# EAGLE schematic Compute Module (EAGLE 9.6.2), part 1 of 2

## Sheet 1 of 11
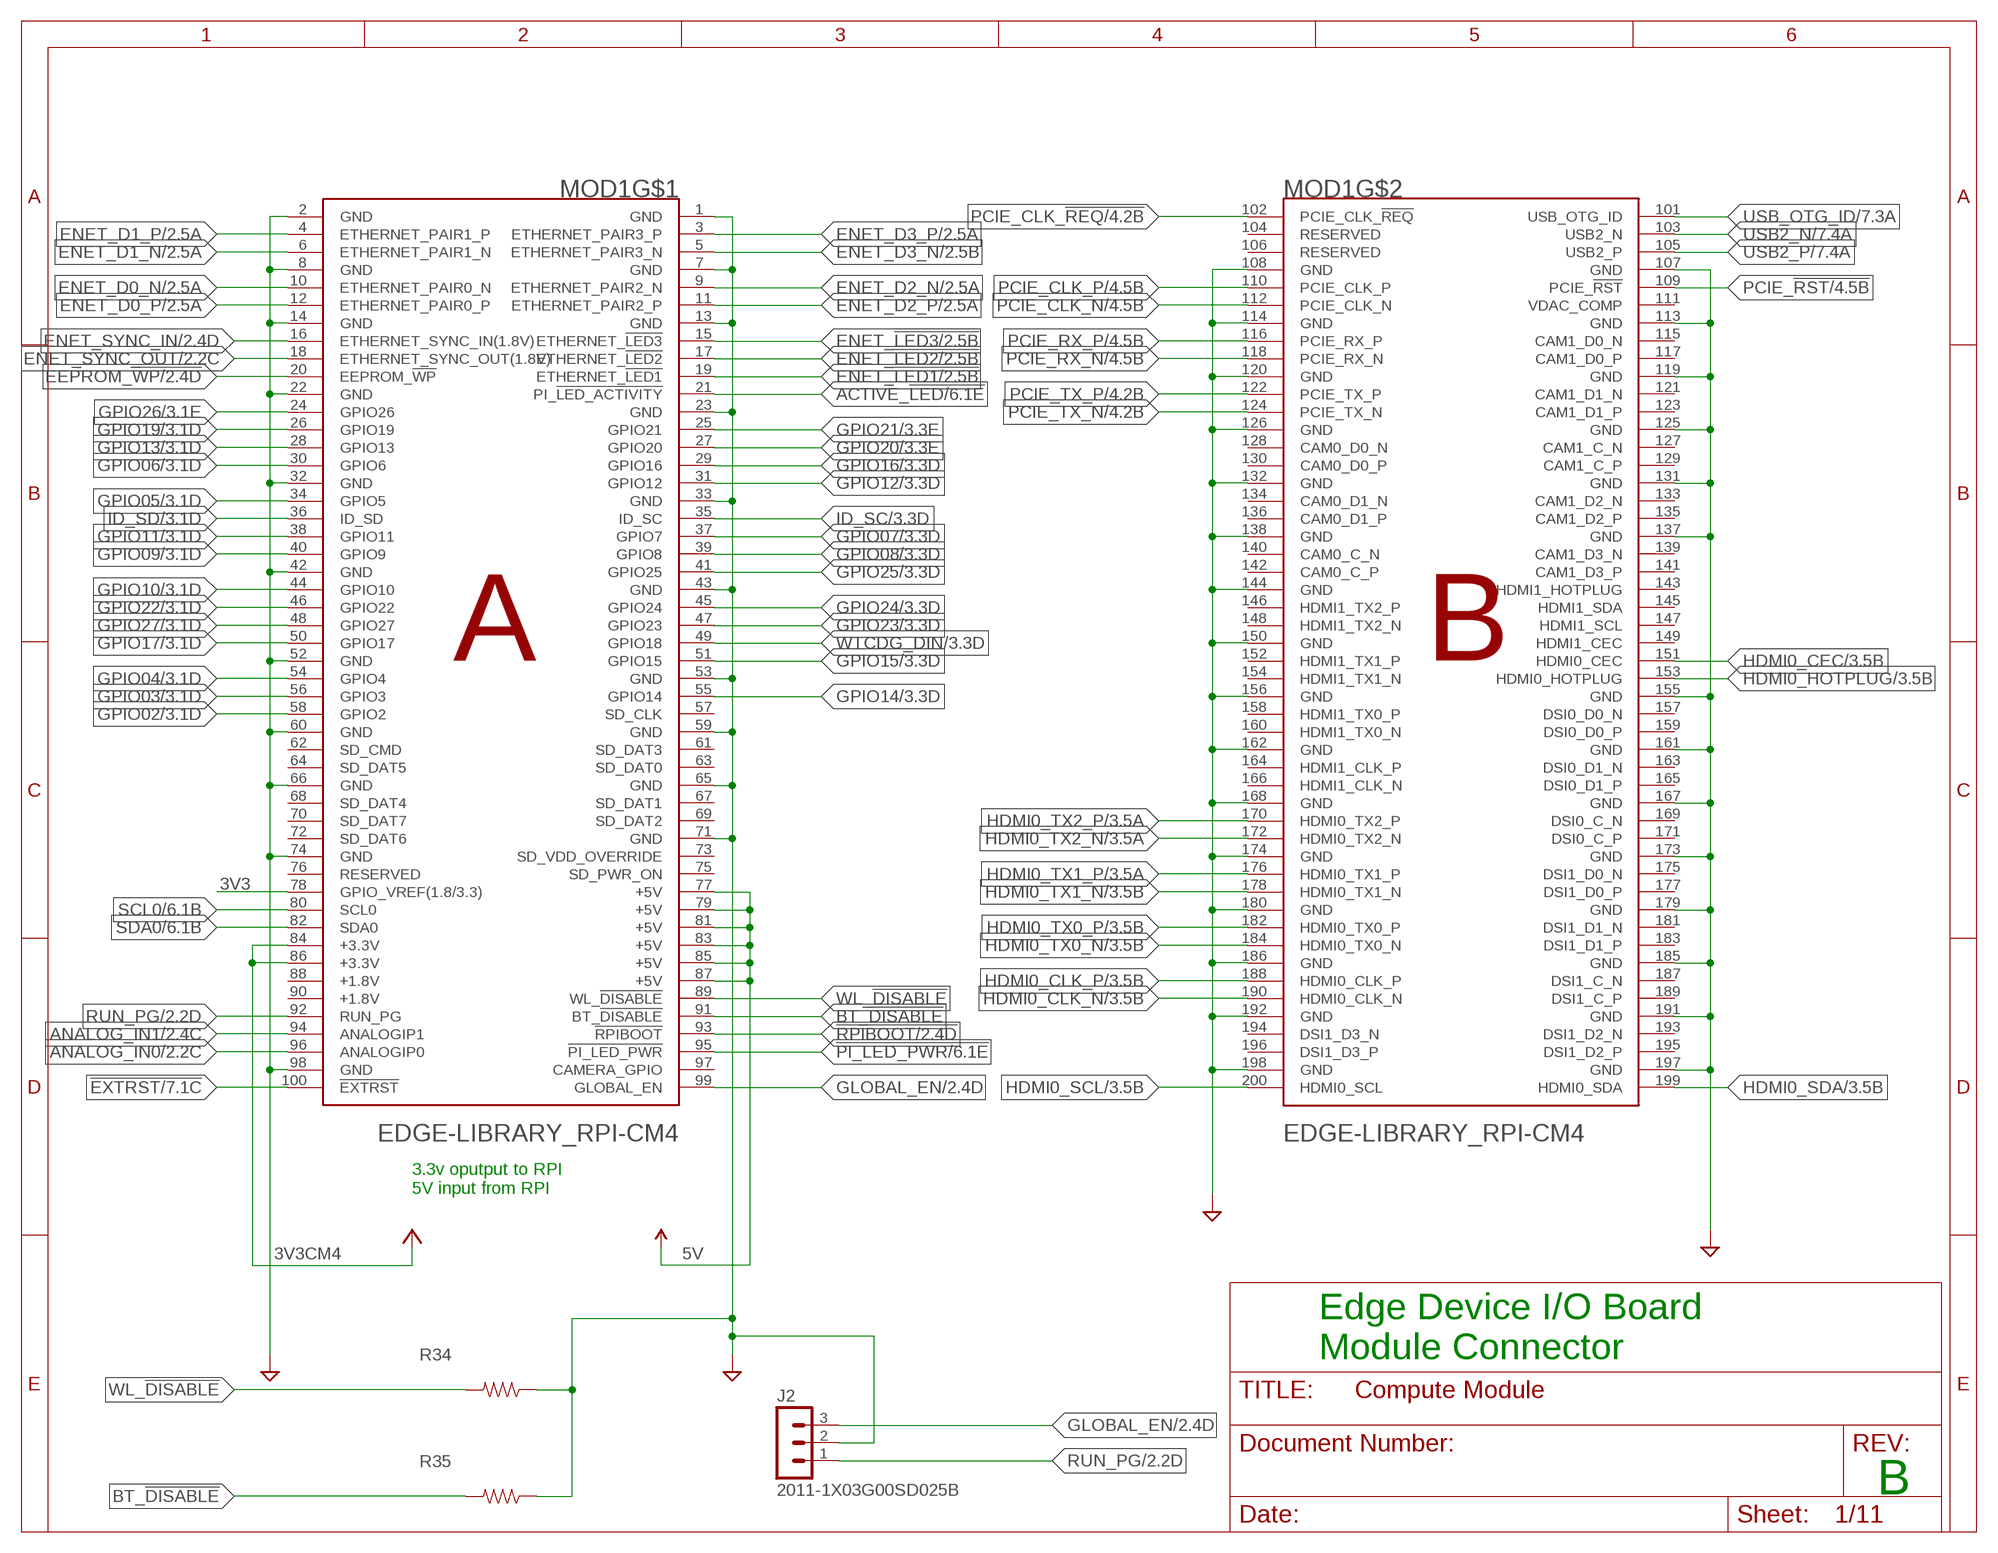
[diagram p0: schematic, sheet 1]

### Parts
J2  2011-1X03G00SD025B  CON-LSTB_MA03-1  [CON-LSTB_MA03-1]
MOD1  EDGE-LIBRARY_RPI-CM4  [EDGE-LIBRARY_RPI-CM4]
R34  EDGE-LIBRARY_RESISTOR0805  [EDGE-LIBRARY_0805]
R35  EDGE-LIBRARY_RESISTOR0805  [EDGE-LIBRARY_0805]

### Nets
3V3: MOD1.78(GPIO_VREF(1.8/3.3)) ; also sheet 2,3,4,5,6,7,9,10
3V3CM4: MOD1.84(+3.3V) MOD1.86(+3.3V) ; supply symbol labelled 3V3
5V: MOD1.77(+5V) MOD1.79(+5V) MOD1.81(+5V) MOD1.83(+5V) MOD1.85(+5V) MOD1.87(+5V) ; supply symbol labelled SUPPLY1_PWR ; also sheet 2,3,5,6
!EXTRST: MOD1.100(!EXTRST) ; also sheet 7
!PI_LED_PWR: MOD1.95(!PI_LED_PWR) ; also sheet 6
!RPIBOOT: MOD1.93(!RPIBOOT) ; also sheet 2,5
ACTIVE_!LED: MOD1.21(PI_!LED_ACTIVITY) ; also sheet 6
ANALOG_IN0: MOD1.96(ANALOGIP0) ; also sheet 2
ANALOG_IN1: MOD1.94(ANALOGIP1) ; also sheet 2
BT_!DISABLE: MOD1.91(BT_!DISABLE) R35.2
EEPROM_!WP: MOD1.20(EEPROM_!WP) ; also sheet 2
ENET_!LED1: MOD1.19(ETHERNET_!LED1) ; also sheet 2
ENET_!LED2: MOD1.17(ETHERNET_!LED2) ; also sheet 2
ENET_!LED3: MOD1.15(ETHERNET_!LED3) ; also sheet 2
ENET_D0_N [Ethernet 100]: MOD1.10(ETHERNET_PAIR0_N) ; also sheet 2
ENET_D0_P [Ethernet 100]: MOD1.12(ETHERNET_PAIR0_P) ; also sheet 2
ENET_D1_N [Ethernet 100]: MOD1.6(ETHERNET_PAIR1_N) ; also sheet 2
ENET_D1_P [Ethernet 100]: MOD1.4(ETHERNET_PAIR1_P) ; also sheet 2
ENET_D2_N [Ethernet 100]: MOD1.9(ETHERNET_PAIR2_N) ; also sheet 2
ENET_D2_P [Ethernet 100]: MOD1.11(ETHERNET_PAIR2_P) ; also sheet 2
ENET_D3_N [Ethernet 100]: MOD1.5(ETHERNET_PAIR3_N) ; also sheet 2
ENET_D3_P [Ethernet 100]: MOD1.3(ETHERNET_PAIR3_P) ; also sheet 2
ENET_SYNC_IN: MOD1.16(ETHERNET_SYNC_IN(1.8V)) ; also sheet 2
ENET_SYNC_OUT: MOD1.18(ETHERNET_SYNC_OUT(1.8V)) ; also sheet 2
GLOBAL_EN: J2.3 MOD1.99(GLOBAL_EN) ; also sheet 2,6
GND: J2.2 MOD1.1(GND) MOD1.2(GND) MOD1.7(GND) MOD1.8(GND) MOD1.13(GND) MOD1.14(GND) MOD1.22(GND) MOD1.23(GND) MOD1.32(GND) MOD1.33(GND) MOD1.42(GND) MOD1.43(GND) MOD1.52(GND) MOD1.53(GND) MOD1.59(GND) MOD1.60(GND) MOD1.65(GND) MOD1.66(GND) MOD1.71(GND) MOD1.74(GND) MOD1.98(GND) MOD1.107(GND) MOD1.108(GND) MOD1.113(GND) MOD1.114(GND) MOD1.119(GND) MOD1.120(GND) MOD1.125(GND) MOD1.126(GND) MOD1.131(GND) MOD1.132(GND) MOD1.137(GND) MOD1.138(GND) MOD1.144(GND) MOD1.150(GND) MOD1.155(GND) MOD1.156(GND) MOD1.161(GND) MOD1.162(GND) MOD1.167(GND) MOD1.168(GND) MOD1.173(GND) MOD1.174(GND) MOD1.179(GND) MOD1.180(GND) MOD1.185(GND) MOD1.186(GND) MOD1.191(GND) MOD1.192(GND) MOD1.197(GND) MOD1.198(GND) R34.1 R35.1 ; supply symbol labelled SUPPLY1_GND ; also sheet 2,3,4,5,6,7,8,9,10,11
GPIO02: MOD1.58(GPIO2) ; also sheet 3
GPIO03: MOD1.56(GPIO3) ; also sheet 3
GPIO04: MOD1.54(GPIO4) ; also sheet 3
GPIO05: MOD1.34(GPIO5) ; also sheet 3,11
GPIO06: MOD1.30(GPIO6) ; also sheet 3
GPIO07: MOD1.37(GPIO7) ; also sheet 3
GPIO08: MOD1.39(GPIO8) ; also sheet 3
GPIO09: MOD1.40(GPIO9) ; also sheet 3
GPIO10: MOD1.44(GPIO10) ; also sheet 3
GPIO11: MOD1.38(GPIO11) ; also sheet 3
GPIO12: MOD1.31(GPIO12) ; also sheet 3,8
GPIO13: MOD1.28(GPIO13) ; also sheet 3
GPIO14: MOD1.55(GPIO14) ; also sheet 3
GPIO15: MOD1.51(GPIO15) ; also sheet 3
GPIO16: MOD1.29(GPIO16) ; also sheet 3
GPIO17: MOD1.50(GPIO17) ; also sheet 3
GPIO19: MOD1.26(GPIO19) ; also sheet 3
GPIO20: MOD1.27(GPIO20) ; also sheet 3
GPIO21: MOD1.25(GPIO21) ; also sheet 3
GPIO22: MOD1.46(GPIO22) ; also sheet 3
GPIO23: MOD1.47(GPIO23) ; also sheet 3
GPIO24: MOD1.45(GPIO24) ; also sheet 3
GPIO25: MOD1.41(GPIO25) ; also sheet 3
GPIO26: MOD1.24(GPIO26) ; also sheet 3
GPIO27: MOD1.48(GPIO27) ; also sheet 3
HDMI0_CEC: MOD1.151(HDMI0_CEC) ; also sheet 3
HDMI0_CLK_N [HDMI 100]: MOD1.190(HDMI0_CLK_N) ; also sheet 3
HDMI0_CLK_P [HDMI 100]: MOD1.188(HDMI0_CLK_P) ; also sheet 3
HDMI0_HOTPLUG: MOD1.153(HDMI0_HOTPLUG) ; also sheet 3
HDMI0_SCL: MOD1.200(HDMI0_SCL) ; also sheet 3
HDMI0_SDA: MOD1.199(HDMI0_SDA) ; also sheet 3
HDMI0_TX0_N [HDMI 100]: MOD1.184(HDMI0_TX0_N) ; also sheet 3
HDMI0_TX0_P [HDMI 100]: MOD1.182(HDMI0_TX0_P) ; also sheet 3
HDMI0_TX1_N [HDMI 100]: MOD1.178(HDMI0_TX1_N) ; also sheet 3
HDMI0_TX1_P [HDMI 100]: MOD1.176(HDMI0_TX1_P) ; also sheet 3
HDMI0_TX2_N [HDMI 100]: MOD1.172(HDMI0_TX2_N) ; also sheet 3
HDMI0_TX2_P [HDMI 100]: MOD1.170(HDMI0_TX2_P) ; also sheet 3
ID_SC: MOD1.35(ID_SC) ; also sheet 3
ID_SD: MOD1.36(ID_SD) ; also sheet 3
PCIE_!RST: MOD1.109(PCIE_!RST) ; also sheet 4
PCIE_CLK_!REQ: MOD1.102(PCIE_CLK_!REQ) ; also sheet 4
PCIE_CLK_N [PCI 90]: MOD1.112(PCIE_CLK_N) ; also sheet 4
PCIE_CLK_P [PCI 90]: MOD1.110(PCIE_CLK_P) ; also sheet 4
PCIE_RX_N [PCI 90]: MOD1.118(PCIE_RX_N) ; also sheet 4
PCIE_RX_P [PCI 90]: MOD1.116(PCIE_RX_P) ; also sheet 4
PCIE_TX_N [PCI 90]: MOD1.124(PCIE_TX_N) ; also sheet 4
PCIE_TX_P [PCI 90]: MOD1.122(PCIE_TX_P) ; also sheet 4
RUN_PG: J2.1 MOD1.92(RUN_PG) ; also sheet 2
SCL0: MOD1.80(SCL0) ; also sheet 6
SDA0: MOD1.82(SDA0) ; also sheet 6
USB2_N [USB 90]: MOD1.103(USB2_N) ; also sheet 7
USB2_P [USB 90]: MOD1.105(USB2_P) ; also sheet 7
USB_OTG_ID: MOD1.101(USB_OTG_ID) ; also sheet 7
WL_!DISABLE: MOD1.89(WL_!DISABLE) R34.2
WTCDG_DIN: MOD1.49(GPIO18) ; also sheet 3,5
Unconnected: MOD1.57(SD_CLK) MOD1.61(SD_DAT3) MOD1.62(SD_CMD) MOD1.63(SD_DAT0) MOD1.64(SD_DAT5) MOD1.67(SD_DAT1) MOD1.68(SD_DAT4) MOD1.69(SD_DAT2) MOD1.70(SD_DAT7) MOD1.72(SD_DAT6) MOD1.73(SD_VDD_OVERRIDE) MOD1.75(SD_PWR_ON) MOD1.76(RESERVED) MOD1.88(+1.8V) MOD1.90(+1.8V) MOD1.97(CAMERA_GPIO) MOD1.104(RESERVED) MOD1.106(RESERVED) MOD1.111(VDAC_COMP) MOD1.115(CAM1_D0_N) MOD1.117(CAM1_D0_P) MOD1.121(CAM1_D1_N) MOD1.123(CAM1_D1_P) MOD1.127(CAM1_C_N) MOD1.128(CAM0_D0_N) MOD1.129(CAM1_C_P) MOD1.130(CAM0_D0_P) MOD1.133(CAM1_D2_N) MOD1.134(CAM0_D1_N) MOD1.135(CAM1_D2_P) MOD1.136(CAM0_D1_P) MOD1.139(CAM1_D3_N) MOD1.140(CAM0_C_N) MOD1.141(CAM1_D3_P) MOD1.142(CAM0_C_P) MOD1.143(HDMI1_HOTPLUG) MOD1.145(HDMI1_SDA) MOD1.146(HDMI1_TX2_P) MOD1.147(HDMI1_SCL) MOD1.148(HDMI1_TX2_N) MOD1.149(HDMI1_CEC) MOD1.152(HDMI1_TX1_P) MOD1.154(HDMI1_TX1_N) MOD1.157(DSI0_D0_N) MOD1.158(HDMI1_TX0_P) MOD1.159(DSI0_D0_P) MOD1.160(HDMI1_TX0_N) MOD1.163(DSI0_D1_N) MOD1.164(HDMI1_CLK_P) MOD1.165(DSI0_D1_P) MOD1.166(HDMI1_CLK_N) MOD1.169(DSI0_C_N) MOD1.171(DSI0_C_P) MOD1.175(DSI1_D0_N) MOD1.177(DSI1_D0_P) MOD1.181(DSI1_D1_N) MOD1.183(DSI1_D1_P) MOD1.187(DSI1_C_N) MOD1.189(DSI1_C_P) MOD1.193(DSI1_D2_N) MOD1.194(DSI1_D3_N) MOD1.195(DSI1_D2_P) MOD1.196(DSI1_D3_P)

### Notes on the sheet
- 3.3v oputput to RPI
  5V input from RPI
- Edge Device I/O Board
  Module Connector
- B

## Sheet 2 of 11
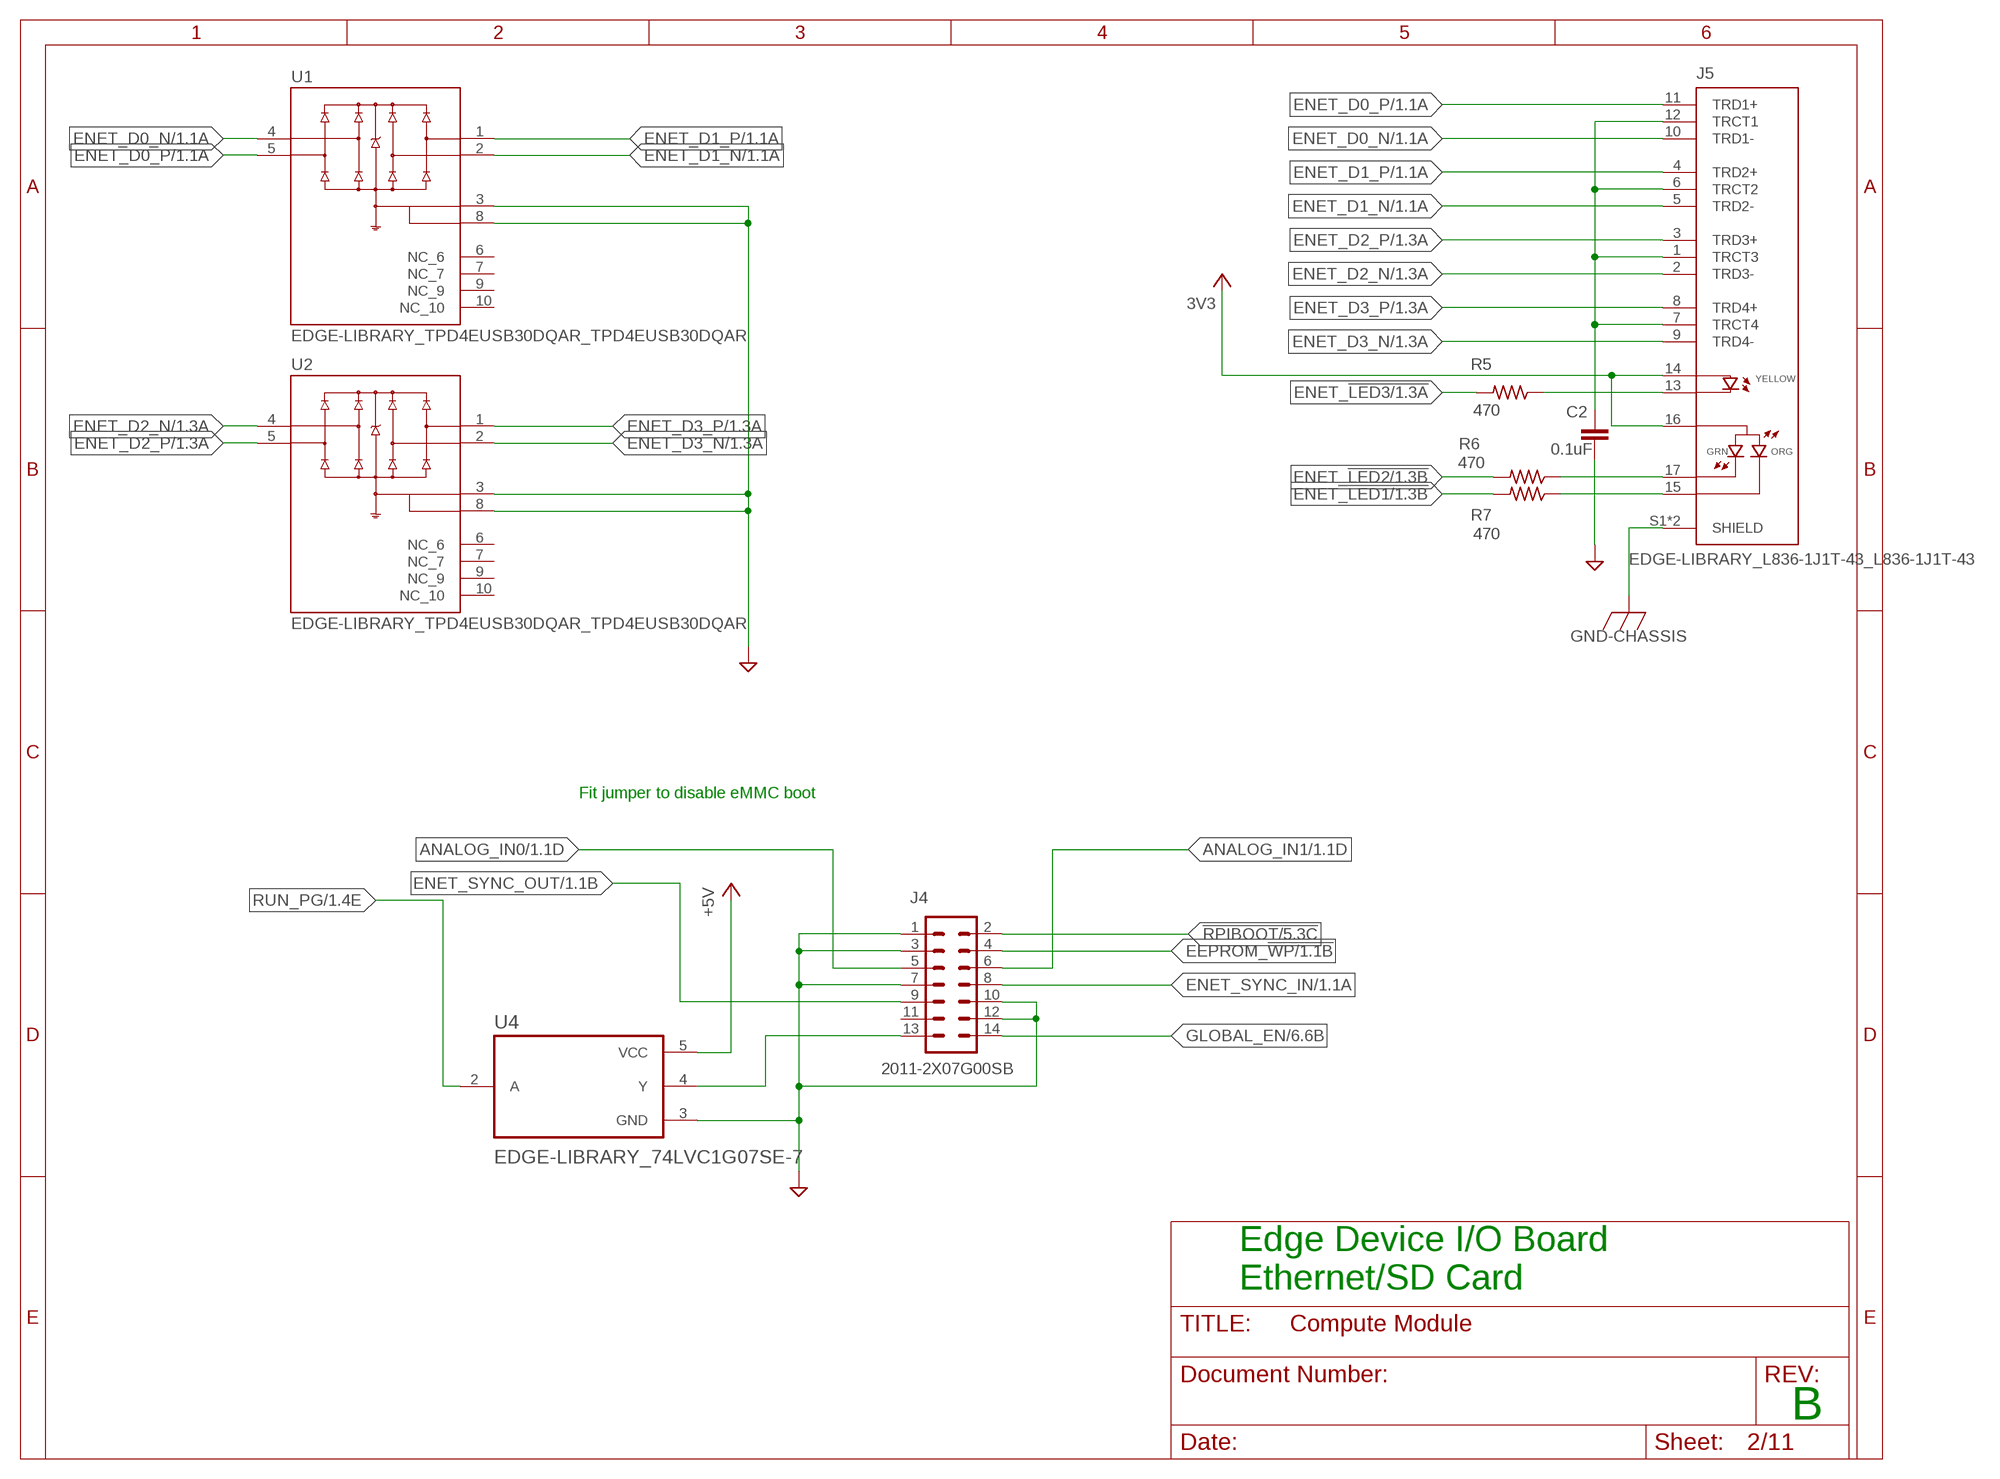
[diagram p1: schematic, sheet 2]

### Parts
C2  0.1uF  EDGE-LIBRARY_TUTORIAL---FUSION-360_CCHIP-0402(1005-METRIC)  [EDGE-LIBRARY_TUTORIAL---FUSION-360_CAPC1005X60]
J4  2011-2X07G00SB  CON-LSTB_MA07-2  [CON-LSTB_MA07-2]
J5  EDGE-LIBRARY_L836-1J1T-43_L836-1J1T-43  [EDGE-LIBRARY_L836-1J1T-43_BEL_L836-1J1T-43]
R5  470  EDGE-LIBRARY_TUTORIAL---FUSION-360_R-USCHIP-0402(1005-METRIC)  [EDGE-LIBRARY_TUTORIAL---FUSION-360_RESC1005X40]
R6  470  EDGE-LIBRARY_TUTORIAL---FUSION-360_R-USCHIP-0402(1005-METRIC)  [EDGE-LIBRARY_TUTORIAL---FUSION-360_RESC1005X40]
R7  470  EDGE-LIBRARY_TUTORIAL---FUSION-360_R-USCHIP-0402(1005-METRIC)  [EDGE-LIBRARY_TUTORIAL---FUSION-360_RESC1005X40]
U1  EDGE-LIBRARY_TPD4EUSB30DQAR_TPD4EUSB30DQAR  [EDGE-LIBRARY_TPD4EUSB30DQAR_IC_TPD4EUSB30DQAR]
U2  EDGE-LIBRARY_TPD4EUSB30DQAR_TPD4EUSB30DQAR  [EDGE-LIBRARY_TPD4EUSB30DQAR_IC_TPD4EUSB30DQAR]
U4  EDGE-LIBRARY_74LVC1G07SE-7  [EDGE-LIBRARY_SOT65P210X110-5N]

### Nets
3V3: J5.14 J5.16 ; also sheet 1,3,4,5,6,7,9,10
5V: U4.5(VCC) ; supply symbol labelled +5V ; also sheet 1,3,5,6
!RPIBOOT: J4.2 ; also sheet 1,5
ANALOG_IN0: J4.5 ; also sheet 1
ANALOG_IN1: J4.6 ; also sheet 1
CGND: J5.S1(SHIELD) J5.S2(SHIELD) ; supply symbol labelled GND-CHASSIS ; also sheet 3,4,7,9
EEPROM_!WP: J4.4 ; also sheet 1
ENET_!LED1: R7.2 ; also sheet 1
ENET_!LED2: R6.2 ; also sheet 1
ENET_!LED3: R5.2 ; also sheet 1
ENET_D0_N [Ethernet 100]: J5.10(TRD1-) U1.4(D2+) ; also sheet 1
ENET_D0_P [Ethernet 100]: J5.11(TRD1+) U1.5(D2-) ; also sheet 1
ENET_D1_N [Ethernet 100]: J5.5(TRD2-) U1.2(D1-) ; also sheet 1
ENET_D1_P [Ethernet 100]: J5.4(TRD2+) U1.1(D1+) ; also sheet 1
ENET_D2_N [Ethernet 100]: J5.2(TRD3-) U2.4(D2+) ; also sheet 1
ENET_D2_P [Ethernet 100]: J5.3(TRD3+) U2.5(D2-) ; also sheet 1
ENET_D3_N [Ethernet 100]: J5.9(TRD4-) U2.2(D1-) ; also sheet 1
ENET_D3_P [Ethernet 100]: J5.8(TRD4+) U2.1(D1+) ; also sheet 1
ENET_SYNC_IN: J4.8 ; also sheet 1
ENET_SYNC_OUT: J4.9 ; also sheet 1
GLOBAL_EN: J4.14 ; also sheet 1,6
GND: C2.2 J4.1 J4.3 J4.7 J4.10 J4.12 U1.3(GND_3) U1.8(GND_8) U2.3(GND_3) U2.8(GND_8) U4.3(GND) ; supply symbol labelled SUPPLY1_GND ; also sheet 1,3,4,5,6,7,8,9,10,11
N$3: C2.1 J5.1(TRCT3) J5.6(TRCT2) J5.7(TRCT4) J5.12(TRCT1)
N$4: J5.13 R5.1
N$11: J5.17 R6.1
N$12: J5.15 R7.1
N$87: J4.13 U4.4(Y)
RUN_PG: U4.2(A) ; also sheet 1
Unconnected: J4.11 U1.6(NC_6) U1.7(NC_7) U1.9(NC_9) U1.10(NC_10) U2.6(NC_6) U2.7(NC_7) U2.9(NC_9) U2.10(NC_10)

### Notes on the sheet
- Fit jumper to disable eMMC boot
- Edge Device I/O Board
  Ethernet/SD Card
- B

## Sheet 3 of 11
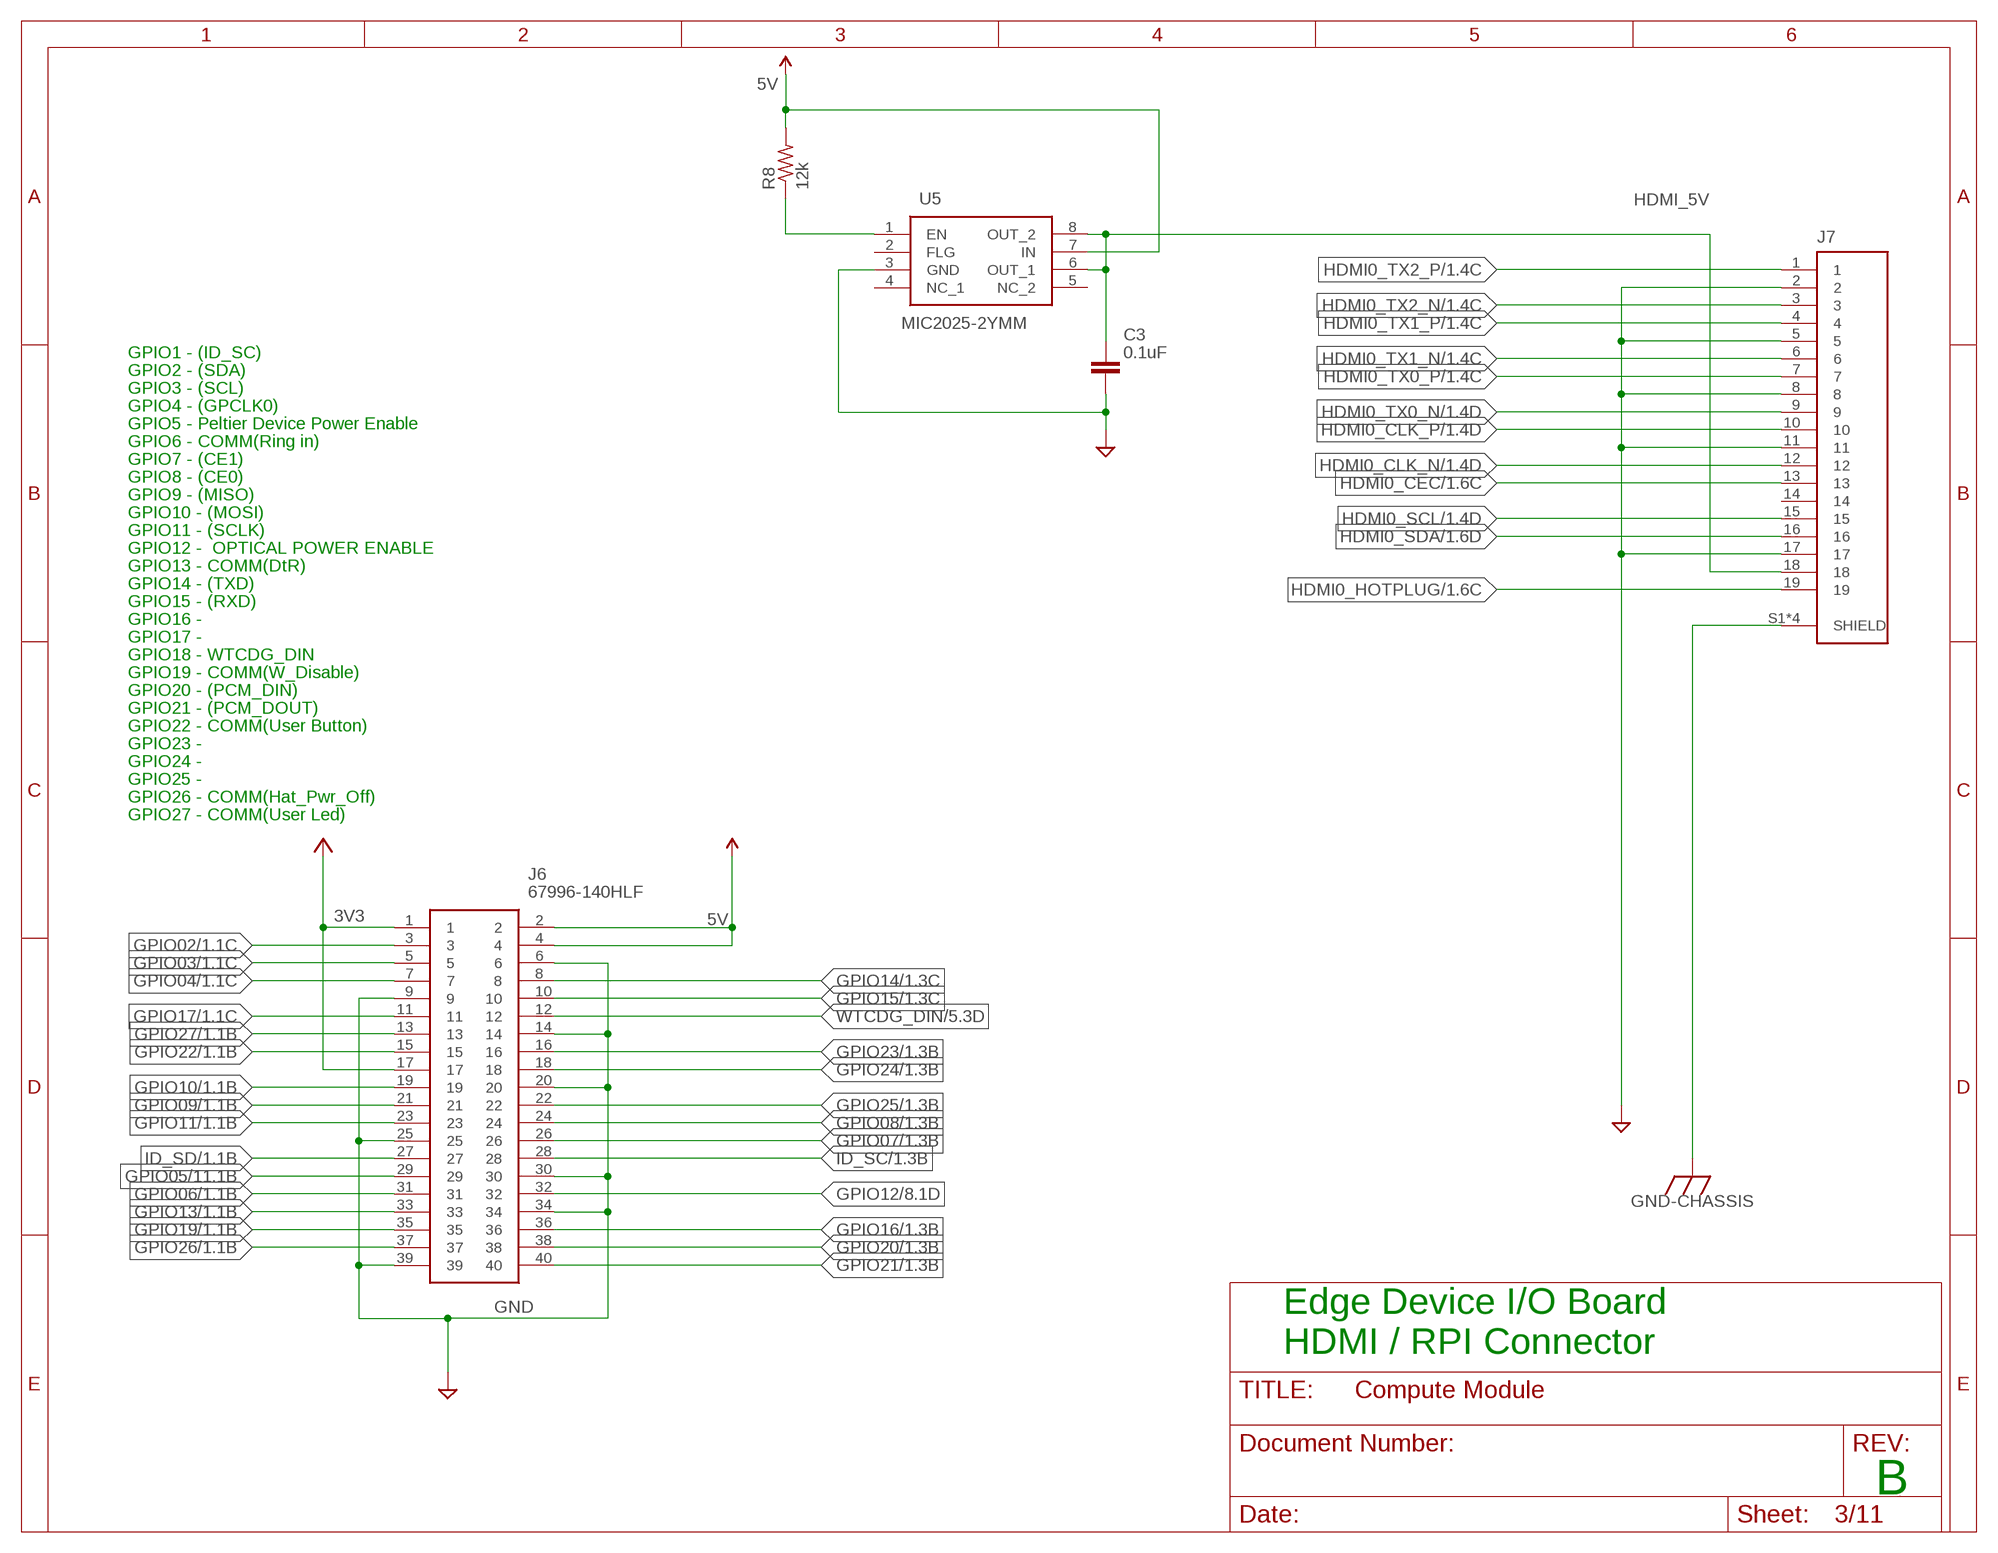
[diagram p2: schematic, sheet 3]

### Parts
C3  0.1uF  EDGE-LIBRARY_TUTORIAL---FUSION-360_CCHIP-0402(1005-METRIC)  [EDGE-LIBRARY_TUTORIAL---FUSION-360_CAPC1005X60]
J6  67996-140HLF  [HDRV40W67P254_2X20_5080X483X85]
J7  EDGE-LIBRARY_HDMI_CONNECTOR_RT_SMA  [EDGE-LIBRARY_STEWART_SS-53000-001]
R8  12k  EDGE-LIBRARY_TUTORIAL---FUSION-360_R-USCHIP-0402(1005-METRIC)  [EDGE-LIBRARY_TUTORIAL---FUSION-360_RESC1005X40]
U5  MIC2025-2YMM  [SOP65P490X110-8N]

### Nets
3V3: J6.1 J6.17 ; also sheet 1,2,4,5,6,7,9,10
5V: J6.2 J6.4 R8.2 U5.7(IN) ; supply symbol labelled SPARKFUN-POWERSYMBOLS_5V ; also sheet 1,2,5,6
CGND: J7.S1(SHIELD) J7.S2(SHIELD) J7.S3(SHIELD) J7.S4(SHIELD) ; supply symbol labelled GND-CHASSIS ; also sheet 2,4,7,9
GND: C3.2 J6.6 J6.9 J6.14 J6.20 J6.25 J6.30 J6.34 J6.39 J7.2 J7.5 J7.8 J7.11 J7.17 U5.3(GND) ; supply symbol labelled SUPPLY1_GND ; also sheet 1,2,4,5,6,7,8,9,10,11
GPIO02: J6.3 ; also sheet 1
GPIO03: J6.5 ; also sheet 1
GPIO04: J6.7 ; also sheet 1
GPIO05: J6.29 ; also sheet 1,11
GPIO06: J6.31 ; also sheet 1
GPIO07: J6.26 ; also sheet 1
GPIO08: J6.24 ; also sheet 1
GPIO09: J6.21 ; also sheet 1
GPIO10: J6.19 ; also sheet 1
GPIO11: J6.23 ; also sheet 1
GPIO12: J6.32 ; also sheet 1,8
GPIO13: J6.33 ; also sheet 1
GPIO14: J6.8 ; also sheet 1
GPIO15: J6.10 ; also sheet 1
GPIO16: J6.36 ; also sheet 1
GPIO17: J6.11 ; also sheet 1
GPIO19: J6.35 ; also sheet 1
GPIO20: J6.38 ; also sheet 1
GPIO21: J6.40 ; also sheet 1
GPIO22: J6.15 ; also sheet 1
GPIO23: J6.16 ; also sheet 1
GPIO24: J6.18 ; also sheet 1
GPIO25: J6.22 ; also sheet 1
GPIO26: J6.37 ; also sheet 1
GPIO27: J6.13 ; also sheet 1
HDMI0_CEC: J7.13 ; also sheet 1
HDMI0_CLK_N [HDMI 100]: J7.12 ; also sheet 1
HDMI0_CLK_P [HDMI 100]: J7.10 ; also sheet 1
HDMI0_HOTPLUG: J7.19 ; also sheet 1
HDMI0_SCL: J7.15 ; also sheet 1
HDMI0_SDA: J7.16 ; also sheet 1
HDMI0_TX0_N [HDMI 100]: J7.9 ; also sheet 1
HDMI0_TX0_P [HDMI 100]: J7.7 ; also sheet 1
HDMI0_TX1_N [HDMI 100]: J7.6 ; also sheet 1
HDMI0_TX1_P [HDMI 100]: J7.4 ; also sheet 1
HDMI0_TX2_N [HDMI 100]: J7.3 ; also sheet 1
HDMI0_TX2_P [HDMI 100]: J7.1 ; also sheet 1
HDMI_5V: C3.1 J7.18 U5.6(OUT_1) U5.8(OUT_2)
ID_SC: J6.28 ; also sheet 1
ID_SD: J6.27 ; also sheet 1
N$7: R8.1 U5.1(EN)
WTCDG_DIN: J6.12 ; also sheet 1,5
Unconnected: J7.14 U5.2(FLG) U5.4(NC_1) U5.5(NC_2)

### Notes on the sheet
- GPIO1 - (ID_SC)
- GPIO2 - (SDA)
- GPIO3 - (SCL)
- GPIO4 - (GPCLK0)
- GPIO5 - Peltier Device Power Enable
- GPIO6 - COMM(Ring in)
- GPIO7 - (CE1)
- GPIO8 - (CE0)
- GPIO9 - (MISO)
- GPIO10 - (MOSI)
- GPIO11 - (SCLK)
- GPIO12 -  OPTICAL POWER ENABLE
- GPIO13 - COMM(DtR)
- GPIO14 - (TXD)
- GPIO15 - (RXD)
- GPIO16 -
- GPIO17 -
- GPIO18 - WTCDG_DIN
- GPIO19 - COMM(W_Disable)
- GPIO20 - (PCM_DIN)
- GPIO21 - (PCM_DOUT)
- GPIO22 - COMM(User Button)
- GPIO23 -
- GPIO24 -
- GPIO25 -
- GPIO26 - COMM(Hat_Pwr_Off)
- GPIO27 - COMM(User Led)
- Edge Device I/O Board
  HDMI / RPI Connector
- B

## Sheet 4 of 11
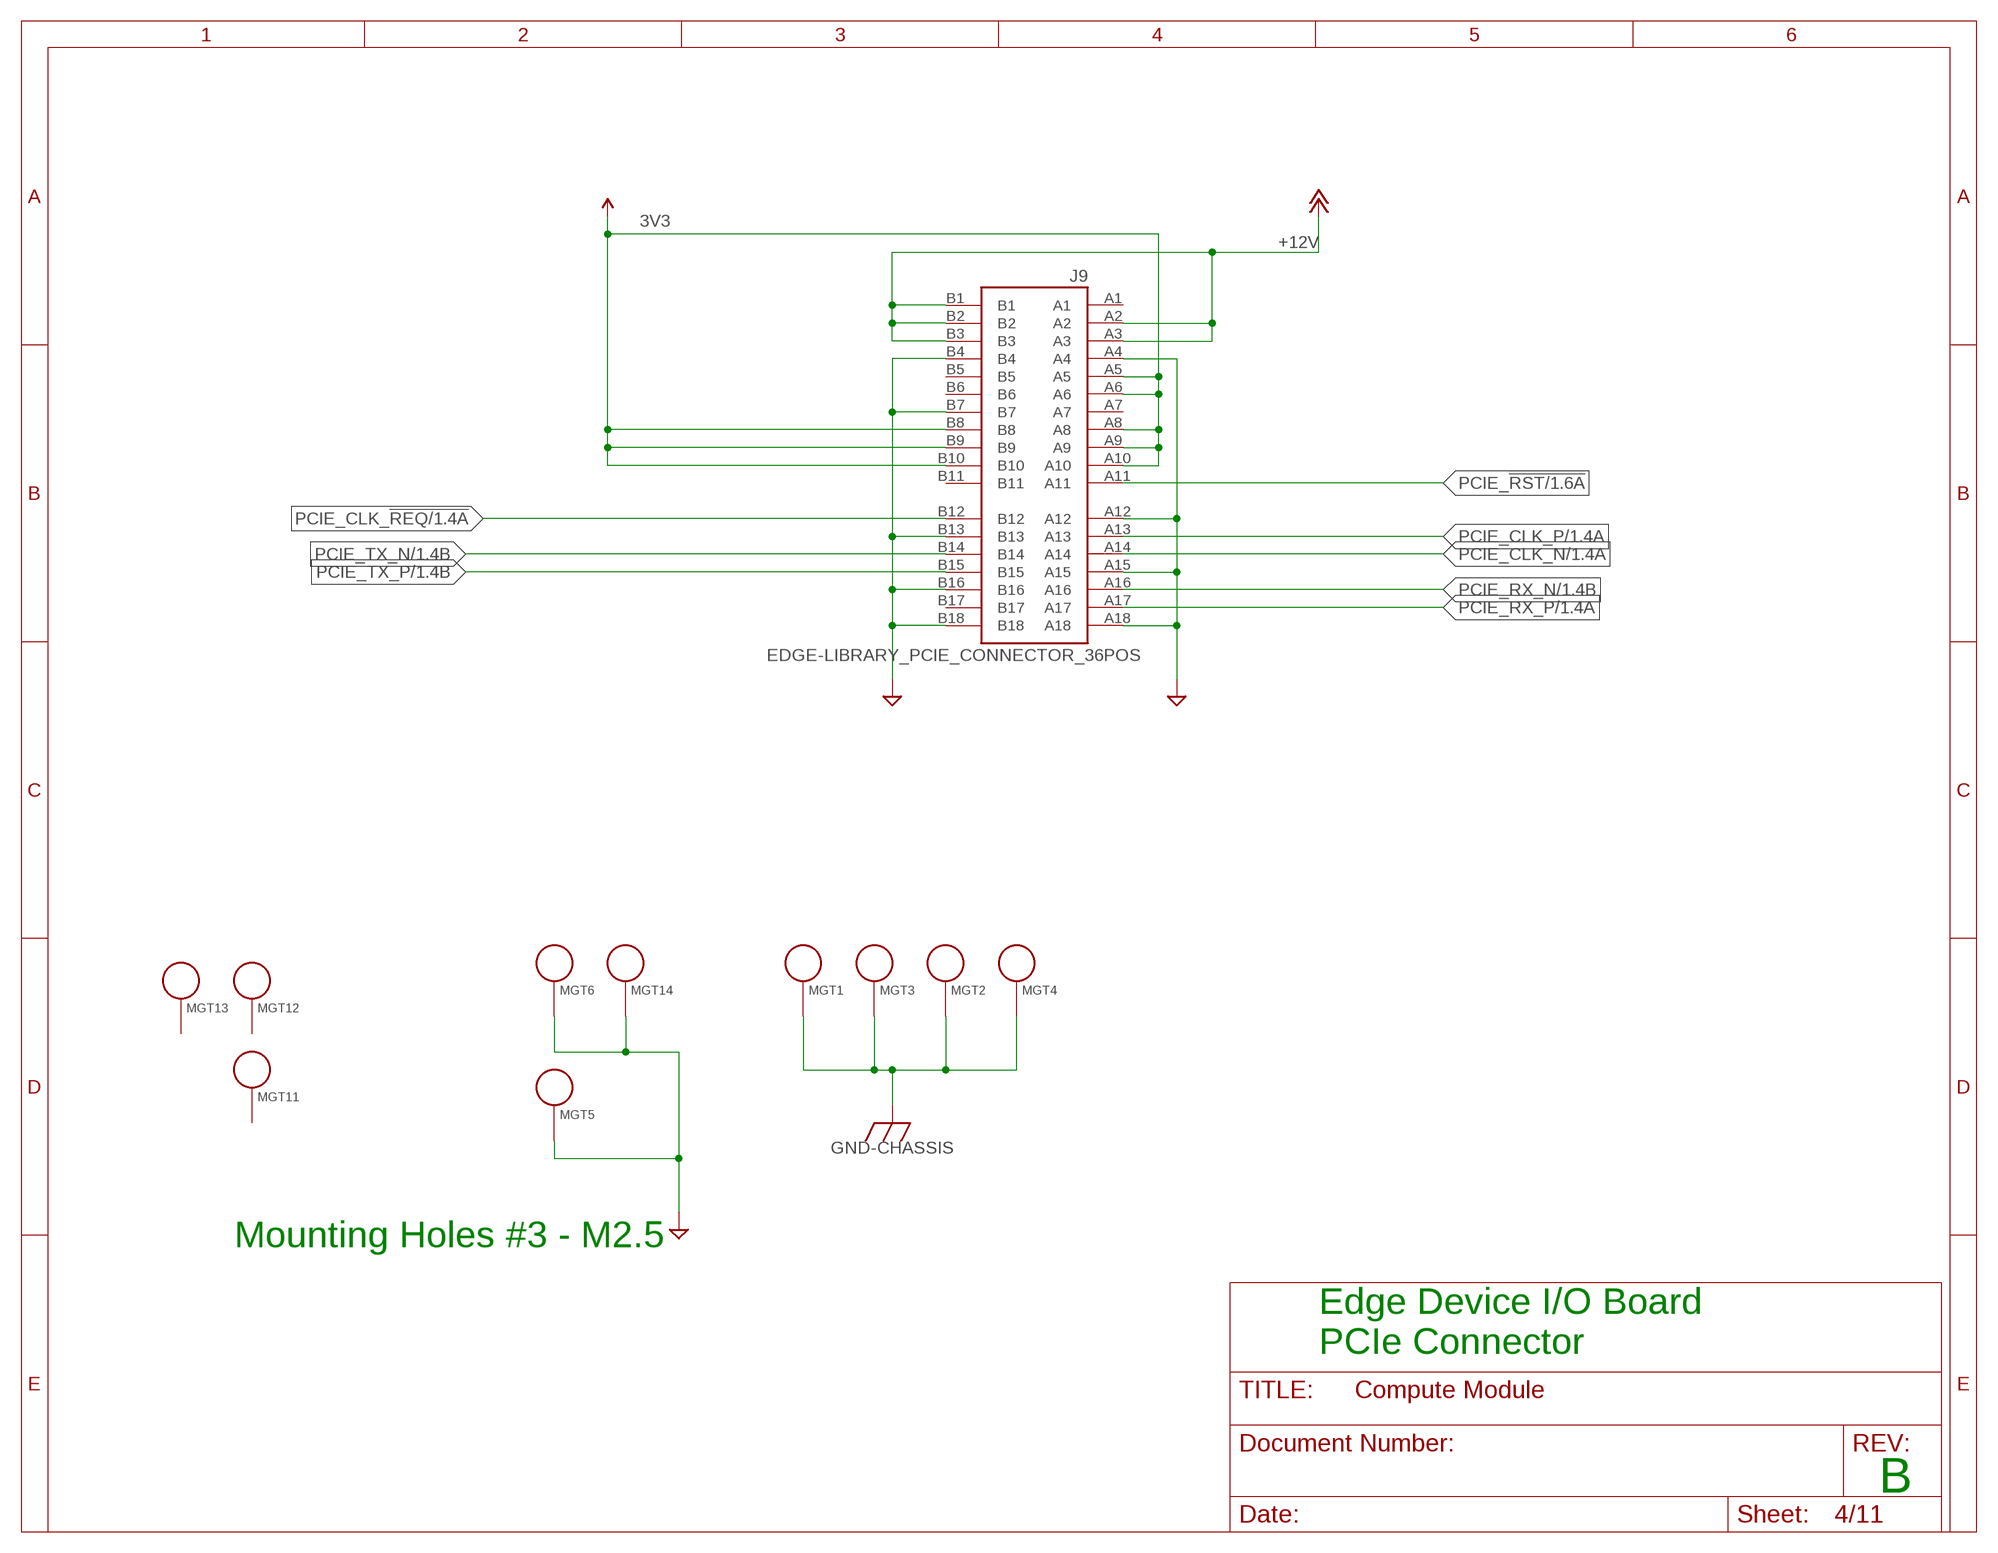
[diagram p3: schematic, sheet 4]

### Parts
J9  EDGE-LIBRARY_PCIE_CONNECTOR_36POS  [EDGE-LIBRARY_AMPHENOL_10018784-10210TLF]
MGT1  MOUNTING_HOLE  [BEAGLEBONEBLACK_MOUNTING_HOLE]
MGT2  MOUNTING_HOLE  [BEAGLEBONEBLACK_MOUNTING_HOLE]
MGT3  MOUNTING_HOLE  [BEAGLEBONEBLACK_MOUNTING_HOLE]
MGT4  MOUNTING_HOLE  [BEAGLEBONEBLACK_MOUNTING_HOLE]
MGT5  MOUNTING_HOLE  [BEAGLEBONEBLACK_MOUNTING_HOLE]
MGT6  MOUNTING_HOLE  [BEAGLEBONEBLACK_MOUNTING_HOLE]
MGT11  MOUNTING_HOLE  [BEAGLEBONEBLACK_MOUNTING_HOLE]
MGT12  MOUNTING_HOLE  [BEAGLEBONEBLACK_MOUNTING_HOLE]
MGT13  MOUNTING_HOLE  [BEAGLEBONEBLACK_MOUNTING_HOLE]
MGT14  MOUNTING_HOLE  [BEAGLEBONEBLACK_MOUNTING_HOLE]

### Nets
3V3: J9.A5 J9.A6 J9.A8 J9.A9 J9.A10 J9.B8 J9.B9 J9.B10 ; supply symbol labelled SPARKFUN-POWERSYMBOLS_5V ; also sheet 1,2,3,5,6,7,9,10
+12V: J9.A2 J9.A3 J9.B1 J9.B2 J9.B3 ; also sheet 5,8,11
CGND: MGT1.P$1 MGT2.P$1 MGT3.P$1 MGT4.P$1 ; supply symbol labelled GND-CHASSIS ; also sheet 2,3,7,9
GND: J9.A4 J9.A12 J9.A15 J9.A18 J9.B4 J9.B7 J9.B13 J9.B16 J9.B18 MGT5.P$1 MGT6.P$1 MGT14.P$1 ; supply symbol labelled SUPPLY1_GND ; also sheet 1,2,3,5,6,7,8,9,10,11
PCIE_!RST: J9.A11 ; also sheet 1
PCIE_CLK_!REQ: J9.B12 ; also sheet 1
PCIE_CLK_N [PCI 90]: J9.A14 ; also sheet 1
PCIE_CLK_P [PCI 90]: J9.A13 ; also sheet 1
PCIE_RX_N [PCI 90]: J9.A16 ; also sheet 1
PCIE_RX_P [PCI 90]: J9.A17 ; also sheet 1
PCIE_TX_N [PCI 90]: J9.B14 ; also sheet 1
PCIE_TX_P [PCI 90]: J9.B15 ; also sheet 1
Unconnected: J9.A1 J9.A7 J9.B5 J9.B6 J9.B11 J9.B17 MGT11.P$1 MGT12.P$1 MGT13.P$1

### Notes on the sheet
- Mounting Holes #3 - M2.5
- Edge Device I/O Board
  PCIe Connector
- B

## Sheet 5 of 11
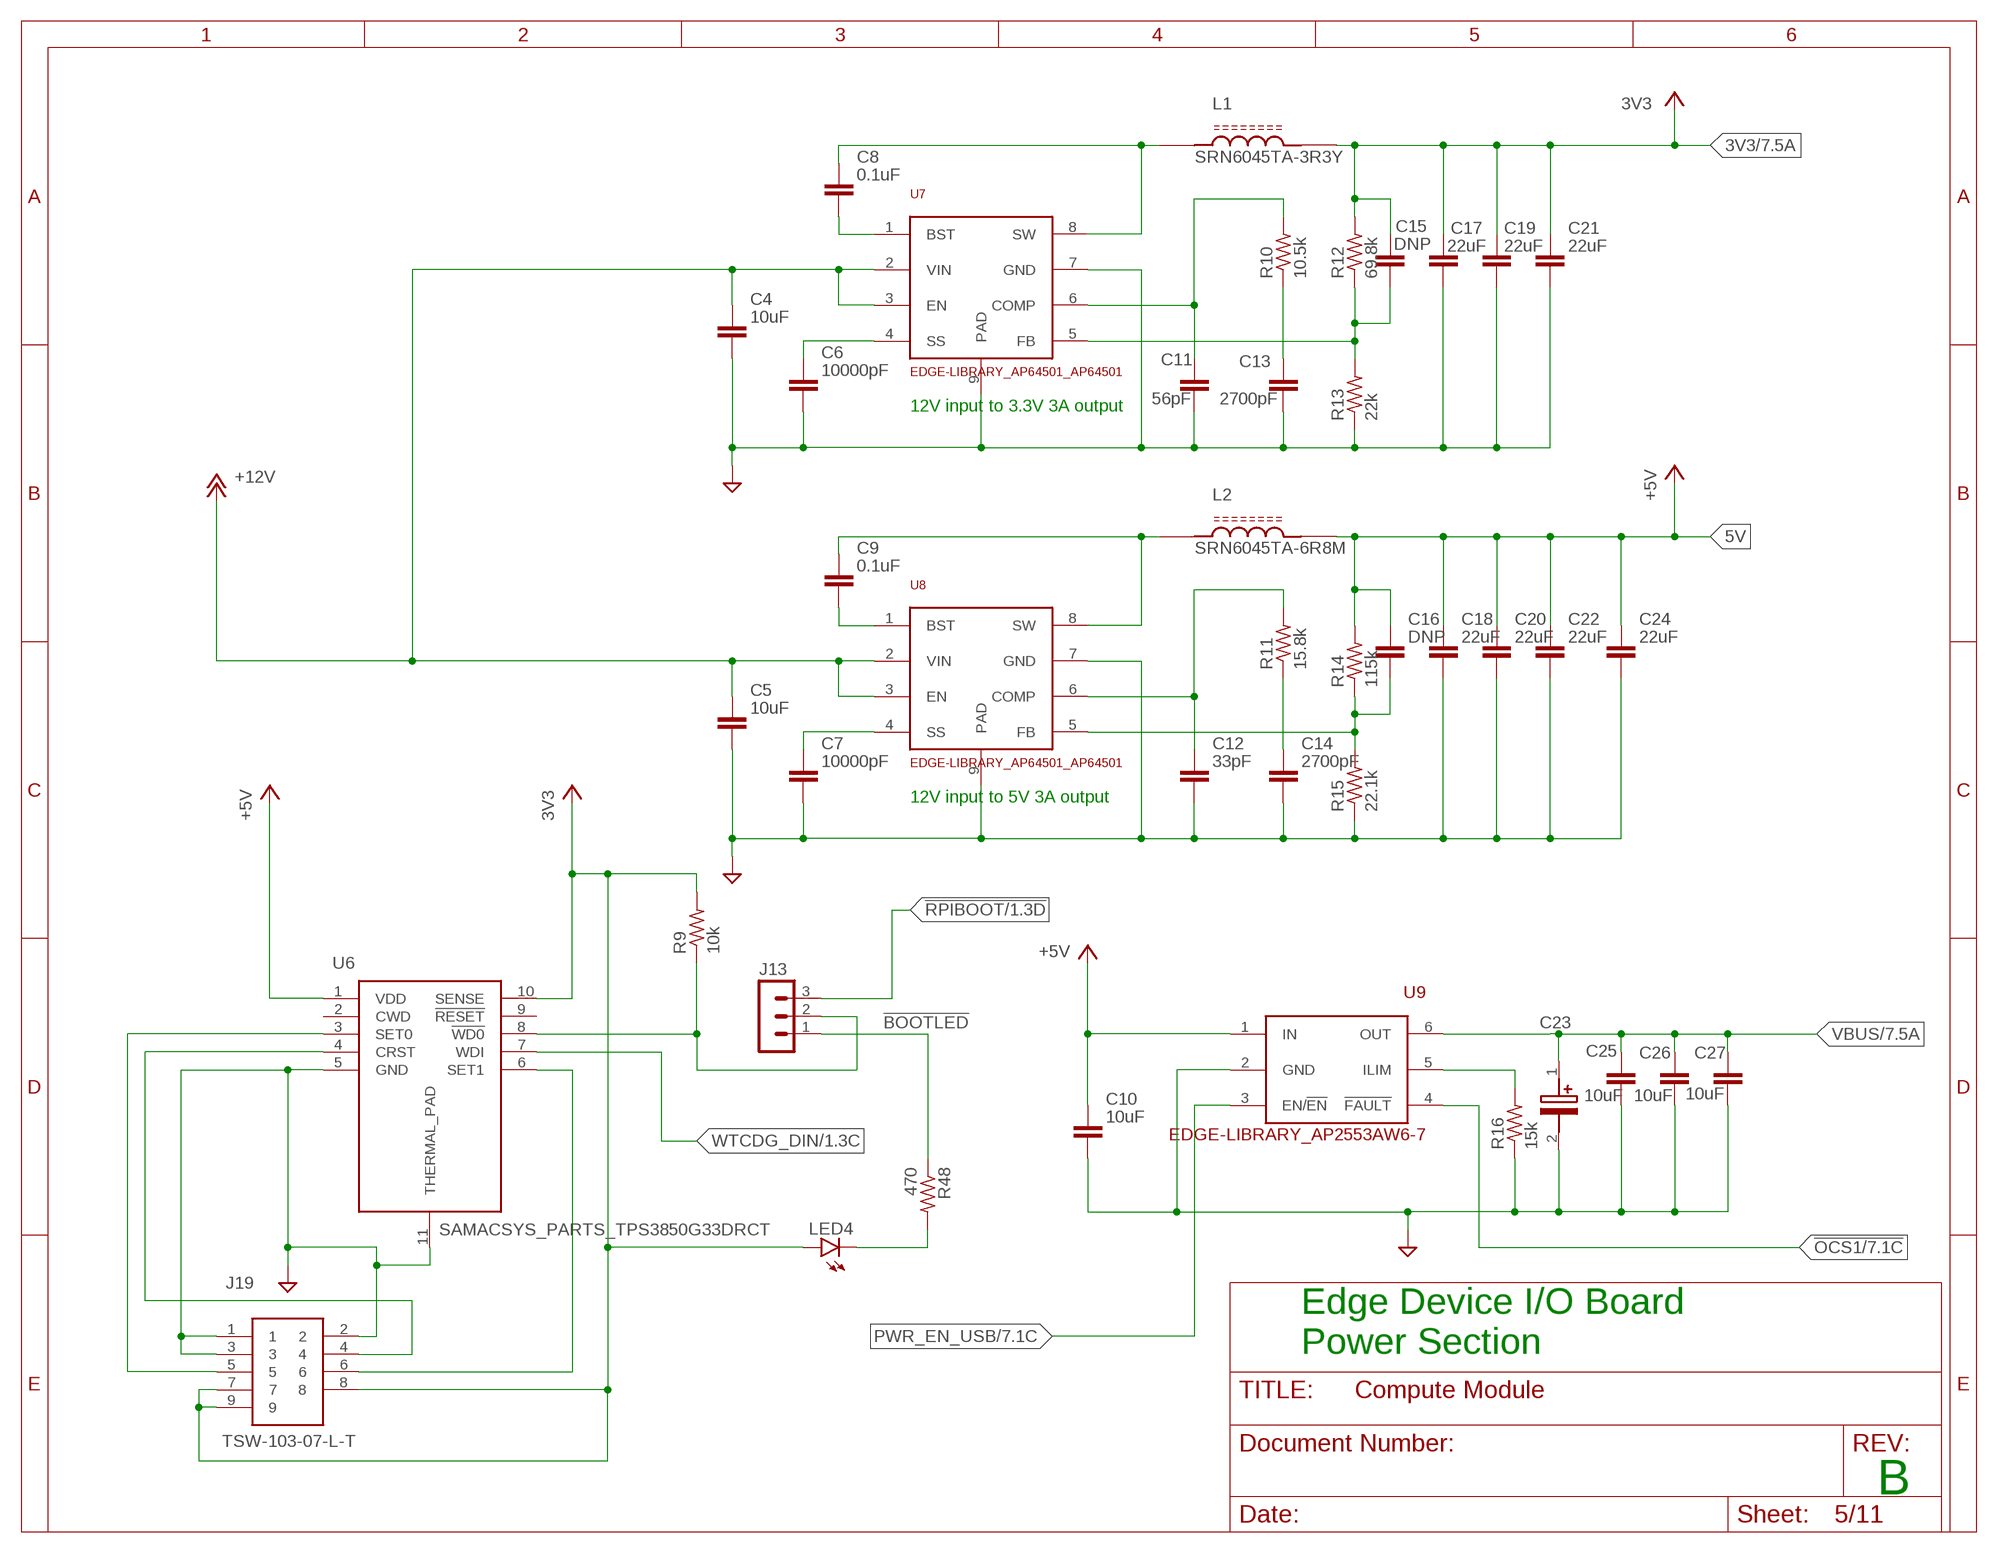
[diagram p4: schematic, sheet 5]

### Parts
C4  10uF  EDGE-LIBRARY_TUTORIAL---FUSION-360_CCHIP-0805(2012-METRIC)  [EDGE-LIBRARY_TUTORIAL---FUSION-360_CAPC2012X110]
C5  10uF  EDGE-LIBRARY_TUTORIAL---FUSION-360_CCHIP-0805(2012-METRIC)  [EDGE-LIBRARY_TUTORIAL---FUSION-360_CAPC2012X110]
C6  10000pF  EDGE-LIBRARY_TUTORIAL---FUSION-360_CCHIP-0402(1005-METRIC)  [EDGE-LIBRARY_TUTORIAL---FUSION-360_CAPC1005X60]
C7  10000pF  EDGE-LIBRARY_TUTORIAL---FUSION-360_CCHIP-0402(1005-METRIC)  [EDGE-LIBRARY_TUTORIAL---FUSION-360_CAPC1005X60]
C8  0.1uF  EDGE-LIBRARY_TUTORIAL---FUSION-360_CCHIP-0402(1005-METRIC)  [EDGE-LIBRARY_TUTORIAL---FUSION-360_CAPC1005X60]
C9  0.1uF  EDGE-LIBRARY_TUTORIAL---FUSION-360_CCHIP-0402(1005-METRIC)  [EDGE-LIBRARY_TUTORIAL---FUSION-360_CAPC1005X60]
C10  10uF  EDGE-LIBRARY_TUTORIAL---FUSION-360_CCHIP-0805(2012-METRIC)  [EDGE-LIBRARY_TUTORIAL---FUSION-360_CAPC2012X110]
C11  56pF  EDGE-LIBRARY_TUTORIAL---FUSION-360_CCHIP-0402(1005-METRIC)  [EDGE-LIBRARY_TUTORIAL---FUSION-360_CAPC1005X60]
C12  33pF  EDGE-LIBRARY_TUTORIAL---FUSION-360_CCHIP-0402(1005-METRIC)  [EDGE-LIBRARY_TUTORIAL---FUSION-360_CAPC1005X60]
C13  2700pF  EDGE-LIBRARY_TUTORIAL---FUSION-360_CCHIP-0402(1005-METRIC)  [EDGE-LIBRARY_TUTORIAL---FUSION-360_CAPC1005X60]
C14  2700pF  EDGE-LIBRARY_TUTORIAL---FUSION-360_CCHIP-0402(1005-METRIC)  [EDGE-LIBRARY_TUTORIAL---FUSION-360_CAPC1005X60]
C15  DNP  EDGE-LIBRARY_TUTORIAL---FUSION-360_CCHIP-0402(1005-METRIC)  [EDGE-LIBRARY_TUTORIAL---FUSION-360_CAPC1005X60]
C16  DNP  EDGE-LIBRARY_TUTORIAL---FUSION-360_CCHIP-0402(1005-METRIC)  [EDGE-LIBRARY_TUTORIAL---FUSION-360_CAPC1005X60]
C17  22uF  EDGE-LIBRARY_TUTORIAL---FUSION-360_CCHIP-0402(1005-METRIC)  [EDGE-LIBRARY_TUTORIAL---FUSION-360_CAPC1005X60]
C18  22uF  EDGE-LIBRARY_TUTORIAL---FUSION-360_CCHIP-0402(1005-METRIC)  [EDGE-LIBRARY_TUTORIAL---FUSION-360_CAPC1005X60]
C19  22uF  EDGE-LIBRARY_TUTORIAL---FUSION-360_CCHIP-0402(1005-METRIC)  [EDGE-LIBRARY_TUTORIAL---FUSION-360_CAPC1005X60]
C20  22uF  EDGE-LIBRARY_TUTORIAL---FUSION-360_CCHIP-0402(1005-METRIC)  [EDGE-LIBRARY_TUTORIAL---FUSION-360_CAPC1005X60]
C21  22uF  EDGE-LIBRARY_TUTORIAL---FUSION-360_CCHIP-0402(1005-METRIC)  [EDGE-LIBRARY_TUTORIAL---FUSION-360_CAPC1005X60]
C22  22uF  EDGE-LIBRARY_TUTORIAL---FUSION-360_CCHIP-0402(1005-METRIC)  [EDGE-LIBRARY_TUTORIAL---FUSION-360_CAPC1005X60]
C23  100uF  875015119003  [CAPPM7343X200N]
C24  22uF  EDGE-LIBRARY_TUTORIAL---FUSION-360_CCHIP-0402(1005-METRIC)  [EDGE-LIBRARY_TUTORIAL---FUSION-360_CAPC1005X60]
C25  10uF  EDGE-LIBRARY_TUTORIAL---FUSION-360_CCHIP-0805(2012-METRIC)  [EDGE-LIBRARY_TUTORIAL---FUSION-360_CAPC2012X110]
C26  10uF  EDGE-LIBRARY_TUTORIAL---FUSION-360_CCHIP-0805(2012-METRIC)  [EDGE-LIBRARY_TUTORIAL---FUSION-360_CAPC2012X110]
C27  10uF  EDGE-LIBRARY_TUTORIAL---FUSION-360_CCHIP-0805(2012-METRIC)  [EDGE-LIBRARY_TUTORIAL---FUSION-360_CAPC2012X110]
J13  2553-2011-1X03G00SB-ND  CON-LSTB_MA03-1  [CON-LSTB_MA03-1]
J19  TSW-103-07-L-T  [HDRV9W64P254_3X3_762X749X838P]
L1  EDGE-LIBRARY_SRN6045TA-3R3Y_SRN6045TA-3R3Y  [EDGE-LIBRARY_SRN6045TA-3R3Y_IND_SRN6045TA-3R3Y]
L2  EDGE-LIBRARY_SRN6045TA-3R3Y_SRN6045TA-3R3Y  [EDGE-LIBRARY_SRN6045TA-3R3Y_IND_SRN6045TA-3R3Y]
LED4  LTST-S270KGKT  LED_LEDCHIP-LED0603  [LED_CHIP-LED0603]
R9  10k  EDGE-LIBRARY_TUTORIAL---FUSION-360_R-USCHIP-0402(1005-METRIC)  [EDGE-LIBRARY_TUTORIAL---FUSION-360_RESC1005X40]
R10  10.5k  EDGE-LIBRARY_TUTORIAL---FUSION-360_R-USCHIP-0402(1005-METRIC)  [EDGE-LIBRARY_TUTORIAL---FUSION-360_RESC1005X40]
R11  15.8k  EDGE-LIBRARY_TUTORIAL---FUSION-360_R-USCHIP-0402(1005-METRIC)  [EDGE-LIBRARY_TUTORIAL---FUSION-360_RESC1005X40]
R12  69.8k  EDGE-LIBRARY_TUTORIAL---FUSION-360_R-USCHIP-0402(1005-METRIC)  [EDGE-LIBRARY_TUTORIAL---FUSION-360_RESC1005X40]
R13  22k  EDGE-LIBRARY_TUTORIAL---FUSION-360_R-USCHIP-0402(1005-METRIC)  [EDGE-LIBRARY_TUTORIAL---FUSION-360_RESC1005X40]
R14  115k  EDGE-LIBRARY_TUTORIAL---FUSION-360_R-USCHIP-0402(1005-METRIC)  [EDGE-LIBRARY_TUTORIAL---FUSION-360_RESC1005X40]
R15  22.1k  EDGE-LIBRARY_TUTORIAL---FUSION-360_R-USCHIP-0402(1005-METRIC)  [EDGE-LIBRARY_TUTORIAL---FUSION-360_RESC1005X40]
R16  15k  EDGE-LIBRARY_TUTORIAL---FUSION-360_R-USCHIP-0402(1005-METRIC)  [EDGE-LIBRARY_TUTORIAL---FUSION-360_RESC1005X40]
R48  470  EDGE-LIBRARY_TUTORIAL---FUSION-360_R-USCHIP-0402(1005-METRIC)  [EDGE-LIBRARY_TUTORIAL---FUSION-360_RESC1005X40]
U6  SAMACSYS_PARTS_TPS3850G33DRCT  [SAMACSYS_PARTS_SON50P300X300X100-11N]
U7  EDGE-LIBRARY_AP64501_AP64501  [EDGE-LIBRARY_AP64501_SOIC127P600X265-9T261X350N]
U8  EDGE-LIBRARY_AP64501_AP64501  [EDGE-LIBRARY_AP64501_SOIC127P600X265-9T261X350N]
U9  EDGE-LIBRARY_AP2553AW6-7  [EDGE-LIBRARY_SOT95P280X140-6N]

### Nets
3V3: C15.1 C17.1 C19.1 C21.1 J19.7 J19.8 J19.9 L1.2 LED4.A R9.2 R12.2 U6.10(SENSE) ; also sheet 1,2,3,4,6,7,9,10
5V: C10.1 C16.1 C18.1 C20.1 C22.1 C24.1 L2.2 R14.2 U6.1(VDD) U9.1(IN) ; supply symbol labelled +5V ; also sheet 1,2,3,6
!BOOTLED: J13.1 R48.1
!OCS1: U9.4(!FAULT) ; also sheet 7
!RPIBOOT: J13.3 ; also sheet 1,2
+12V: C4.1 C5.1 U7.2(VIN) U7.3(EN) U8.2(VIN) U8.3(EN) ; also sheet 4,8,11
GND: C4.2 C5.2 C6.2 C7.2 C10.2 C11.2 C12.2 C13.2 C14.2 C17.2 C18.2 C19.2 C20.2 C21.2 C22.2 C23.2(-) C24.2 C25.2 C26.2 C27.2 J19.1 J19.2 J19.3 R13.1 R15.1 R16.1 U6.5(GND) U6.11(THERMAL_PAD) U7.7(GND) U7.9(PAD) U8.7(GND) U8.9(PAD) U9.2(GND) ; supply symbol labelled SUPPLY1_GND ; also sheet 1,2,3,4,6,7,8,9,10,11
N$1: J19.6 U6.6(SET1)
N$9: C8.2 U7.1(BST)
N$10: C8.1 L1.1 U7.8(SW)
N$14: C6.1 U7.4(SS)
N$15: C11.1 R10.2 U7.6(COMP)
N$16: C13.1 R10.1
N$17: C15.2 R12.1 R13.2 U7.5(FB)
N$19: R16.2 U9.5(ILIM)
N$20: C9.2 U8.1(BST)
N$21: C9.1 L2.1 U8.8(SW)
N$23: C7.1 U8.4(SS)
N$24: C12.1 R11.2 U8.6(COMP)
N$25: C14.1 R11.1
N$26: C16.2 R14.1 R15.2 U8.5(FB)
N$43: J13.2 R9.1 U6.8(!WD0)
N$45: LED4.C R48.2
N$48: J19.5 U6.3(SET0)
N$92: J19.4 U6.4(CRST)
PWR_EN_USB: U9.3(EN/!EN) ; also sheet 7
VBUS: C23.1(+) C25.1 C26.1 C27.1 U9.6(OUT) ; also sheet 7
WTCDG_DIN: U6.7(WDI) ; also sheet 1,3
Unconnected: U6.2(CWD) U6.9(!RESET)

### Notes on the sheet
- 12V input to 3.3V 3A output
- 12V input to 5V 3A output
- Edge Device I/O Board
  Power Section
- B

## Sheet 6 of 11
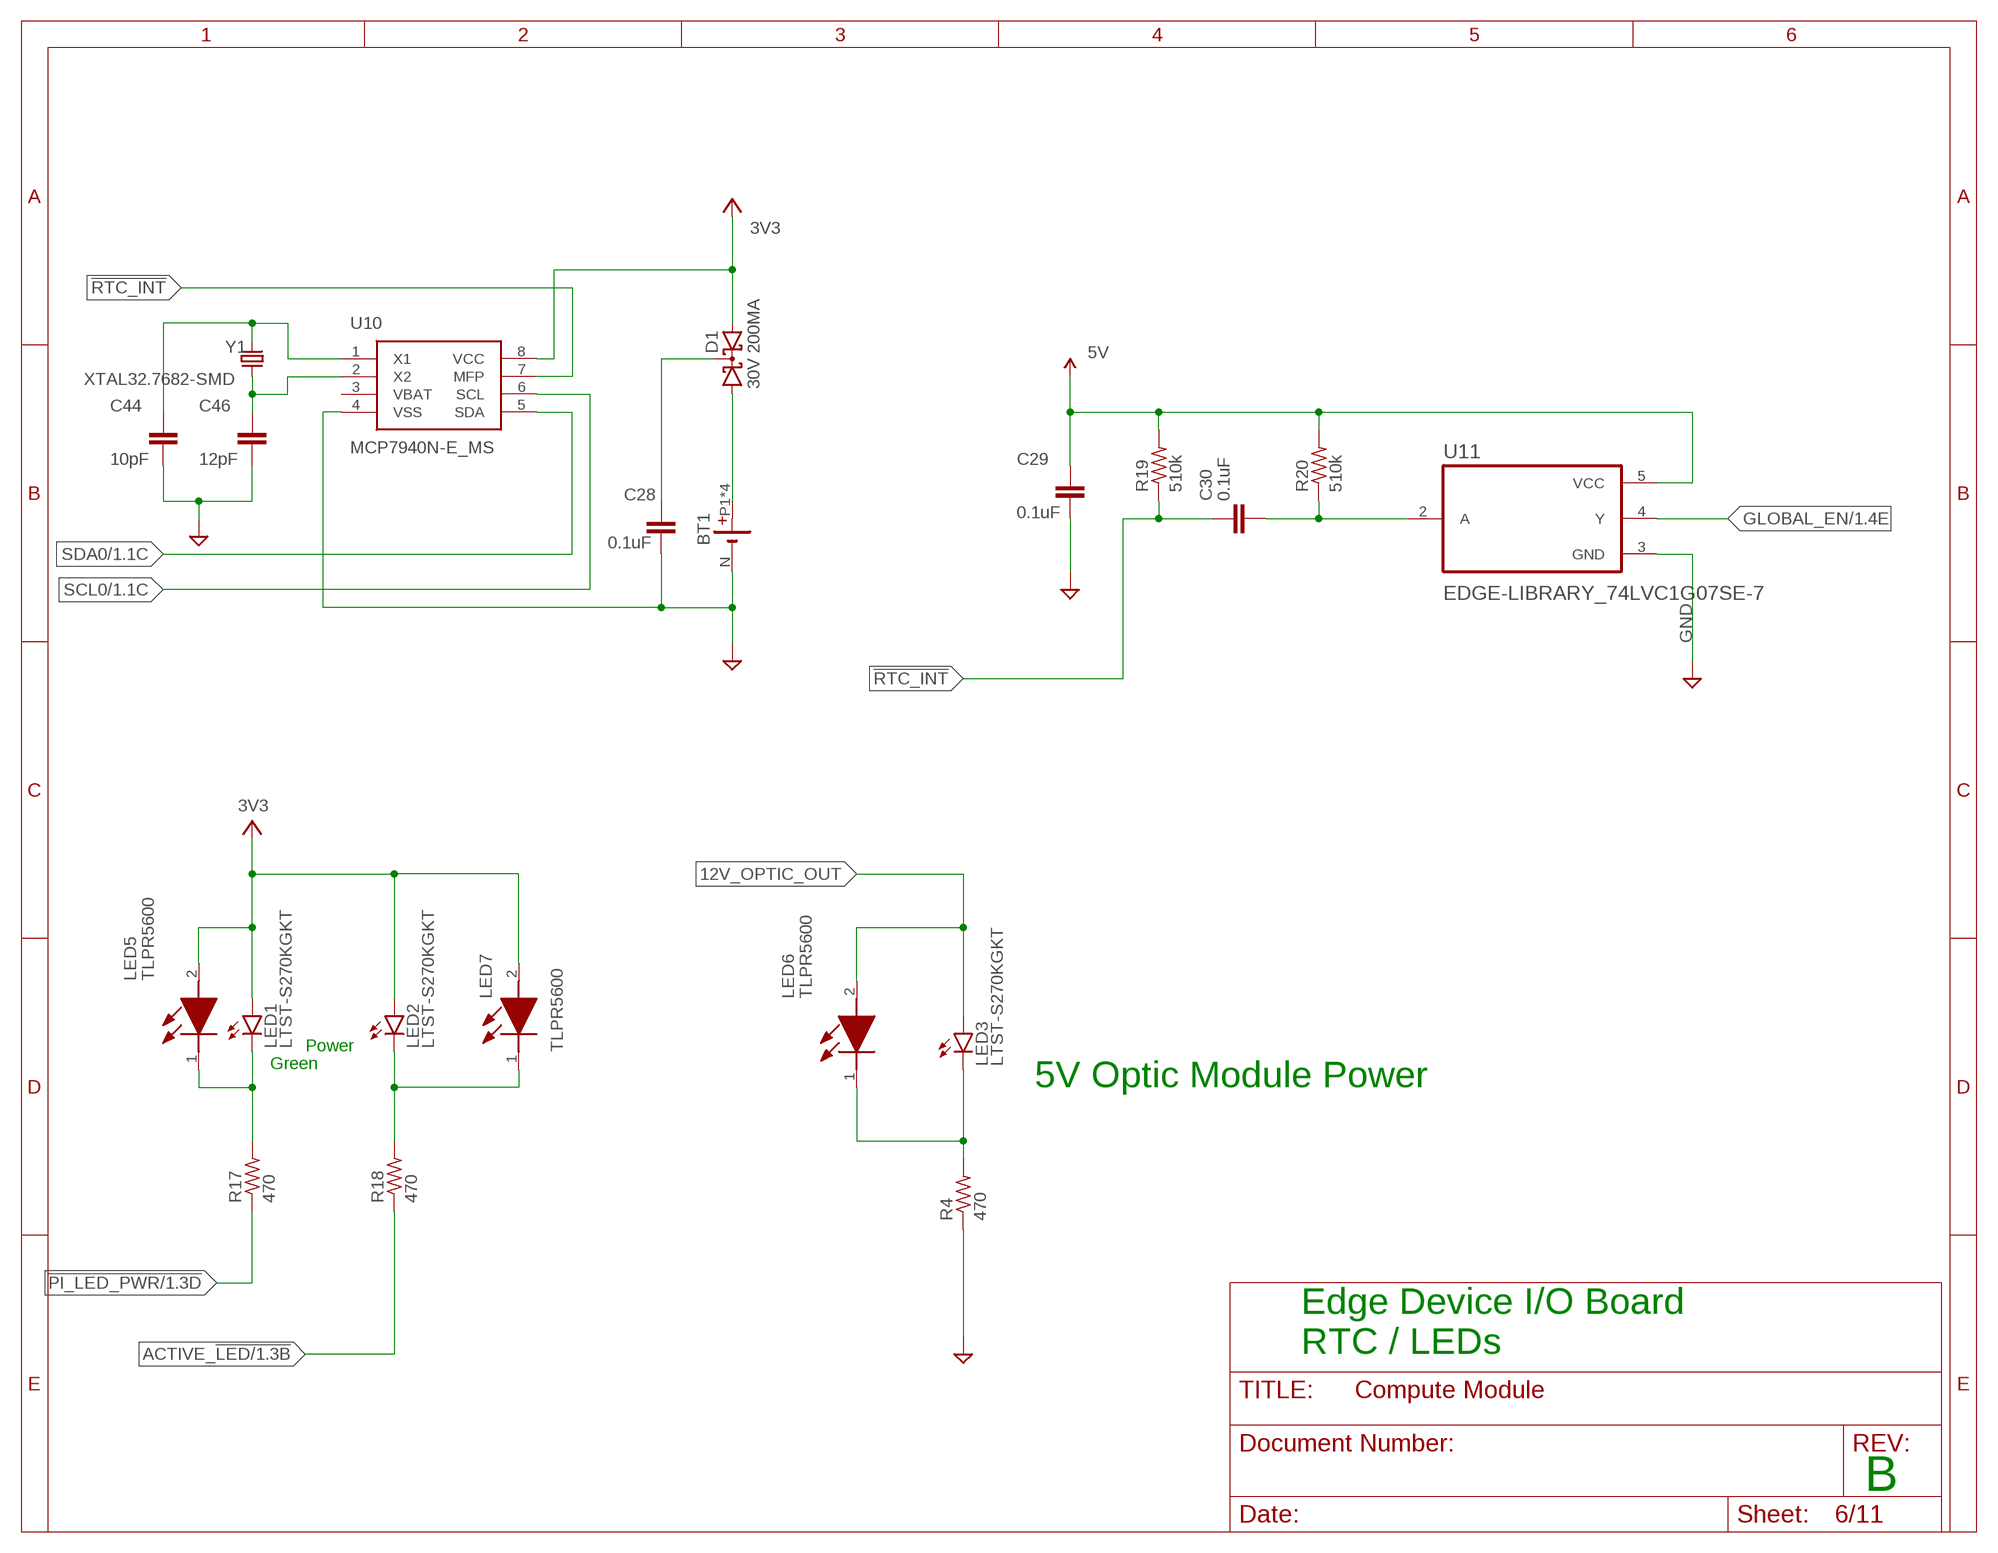
[diagram p5: schematic, sheet 6]

### Parts
BT1  EDGE-LIBRARY_BATTERY_HOLDER  [EDGE-LIBRARY_79523141]
C28  0.1uF  EDGE-LIBRARY_TUTORIAL---FUSION-360_CCHIP-0402(1005-METRIC)  [EDGE-LIBRARY_TUTORIAL---FUSION-360_CAPC1005X60]
C29  0.1uF  EDGE-LIBRARY_TUTORIAL---FUSION-360_CCHIP-0402(1005-METRIC)  [EDGE-LIBRARY_TUTORIAL---FUSION-360_CAPC1005X60]
C30  0.1uF  EDGE-LIBRARY_TUTORIAL---FUSION-360_CCHIP-0402(1005-METRIC)  [EDGE-LIBRARY_TUTORIAL---FUSION-360_CAPC1005X60]
C44  10pF  EDGE-LIBRARY_TUTORIAL---FUSION-360_CCHIP-0402(1005-METRIC)  [EDGE-LIBRARY_TUTORIAL---FUSION-360_CAPC1005X60]
C46  12pF  EDGE-LIBRARY_TUTORIAL---FUSION-360_CCHIP-0402(1005-METRIC)  [EDGE-LIBRARY_TUTORIAL---FUSION-360_CAPC1005X60]
D1  30V 200MA  EDGE-LIBRARY_BAT54C  [EDGE-LIBRARY_SOT23]
LED1  LTST-S270KGKT  LED_LEDCHIP-LED0603  [LED_CHIP-LED0603]
LED2  LTST-S270KGKT  LED_LEDCHIP-LED0603  [LED_CHIP-LED0603]
LED3  LTST-S270KGKT  LED_LEDCHIP-LED0603  [LED_CHIP-LED0603]
LED5  TLPR5600  [TLPP5600]
LED6  TLPR5600  [TLPP5600]
LED7  TLPR5600  [TLPP5600]
R4  470  EDGE-LIBRARY_TUTORIAL---FUSION-360_R-USCHIP-0402(1005-METRIC)  [EDGE-LIBRARY_TUTORIAL---FUSION-360_RESC1005X40]
R17  470  EDGE-LIBRARY_TUTORIAL---FUSION-360_R-USCHIP-0402(1005-METRIC)  [EDGE-LIBRARY_TUTORIAL---FUSION-360_RESC1005X40]
R18  470  EDGE-LIBRARY_TUTORIAL---FUSION-360_R-USCHIP-0402(1005-METRIC)  [EDGE-LIBRARY_TUTORIAL---FUSION-360_RESC1005X40]
R19  510k  EDGE-LIBRARY_TUTORIAL---FUSION-360_R-USCHIP-0402(1005-METRIC)  [EDGE-LIBRARY_TUTORIAL---FUSION-360_RESC1005X40]
R20  510k  EDGE-LIBRARY_TUTORIAL---FUSION-360_R-USCHIP-0402(1005-METRIC)  [EDGE-LIBRARY_TUTORIAL---FUSION-360_RESC1005X40]
U10  MCP7940N-E_MS  [SOP65P490X110-8N]
U11  EDGE-LIBRARY_74LVC1G07SE-7  [EDGE-LIBRARY_SOT65P210X110-5N]
Y1  XTAL32.7682-SMD  [XTAL_ECS-.327-12.5-34R-TR]

### Nets
3V3: D1.2(A2) LED1.A LED2.A LED5.2(A) LED7.2(A) U10.8(VCC) ; supply symbol labelled +3V3 ; also sheet 1,2,3,4,5,7,9,10
5V: C29.1 R19.2 R20.2 U11.5(VCC) ; supply symbol labelled SPARKFUN-POWERSYMBOLS_5V ; also sheet 1,2,3,5
12V_OPTIC_OUT: LED3.A LED6.2(A) ; also sheet 8
!PI_LED_PWR: R17.1 ; also sheet 1
!RTC_INT: C30.1 R19.1 U10.7(MFP)
ACTIVE_!LED: R18.1 ; also sheet 1
GLOBAL_EN: U11.4(Y) ; also sheet 1,2
GND: BT1.N(-) C28.2 C29.2 C44.2 C46.2 R4.1 U10.4(VSS) U11.3(GND) ; supply symbol labelled SUPPLY1_GND ; also sheet 1,2,3,4,5,7,8,9,10,11
N$18: C44.1 U10.1(X1) Y1.2
N$27: C46.1 U10.2(X2) Y1.1
N$30: C28.1 D1.3(CC)
N$31: BT1.P1(+) BT1.P2(+) BT1.P3(+) BT1.P4(+) D1.1(A1)
N$32: C30.2 R20.1 U11.2(A)
N$44: LED3.C LED6.1(K) R4.2
N$49: LED1.C LED5.1(K) R17.2
N$88: LED2.C LED7.1(K) R18.2
SCL0: U10.6(SCL) ; also sheet 1
SDA0: U10.5(SDA) ; also sheet 1
Unconnected: U10.3(VBAT)

### Notes on the sheet
- Power
- Green
- 5V Optic Module Power
- Edge Device I/O Board
  RTC / LEDs
- B

## Sheet 7 of 11
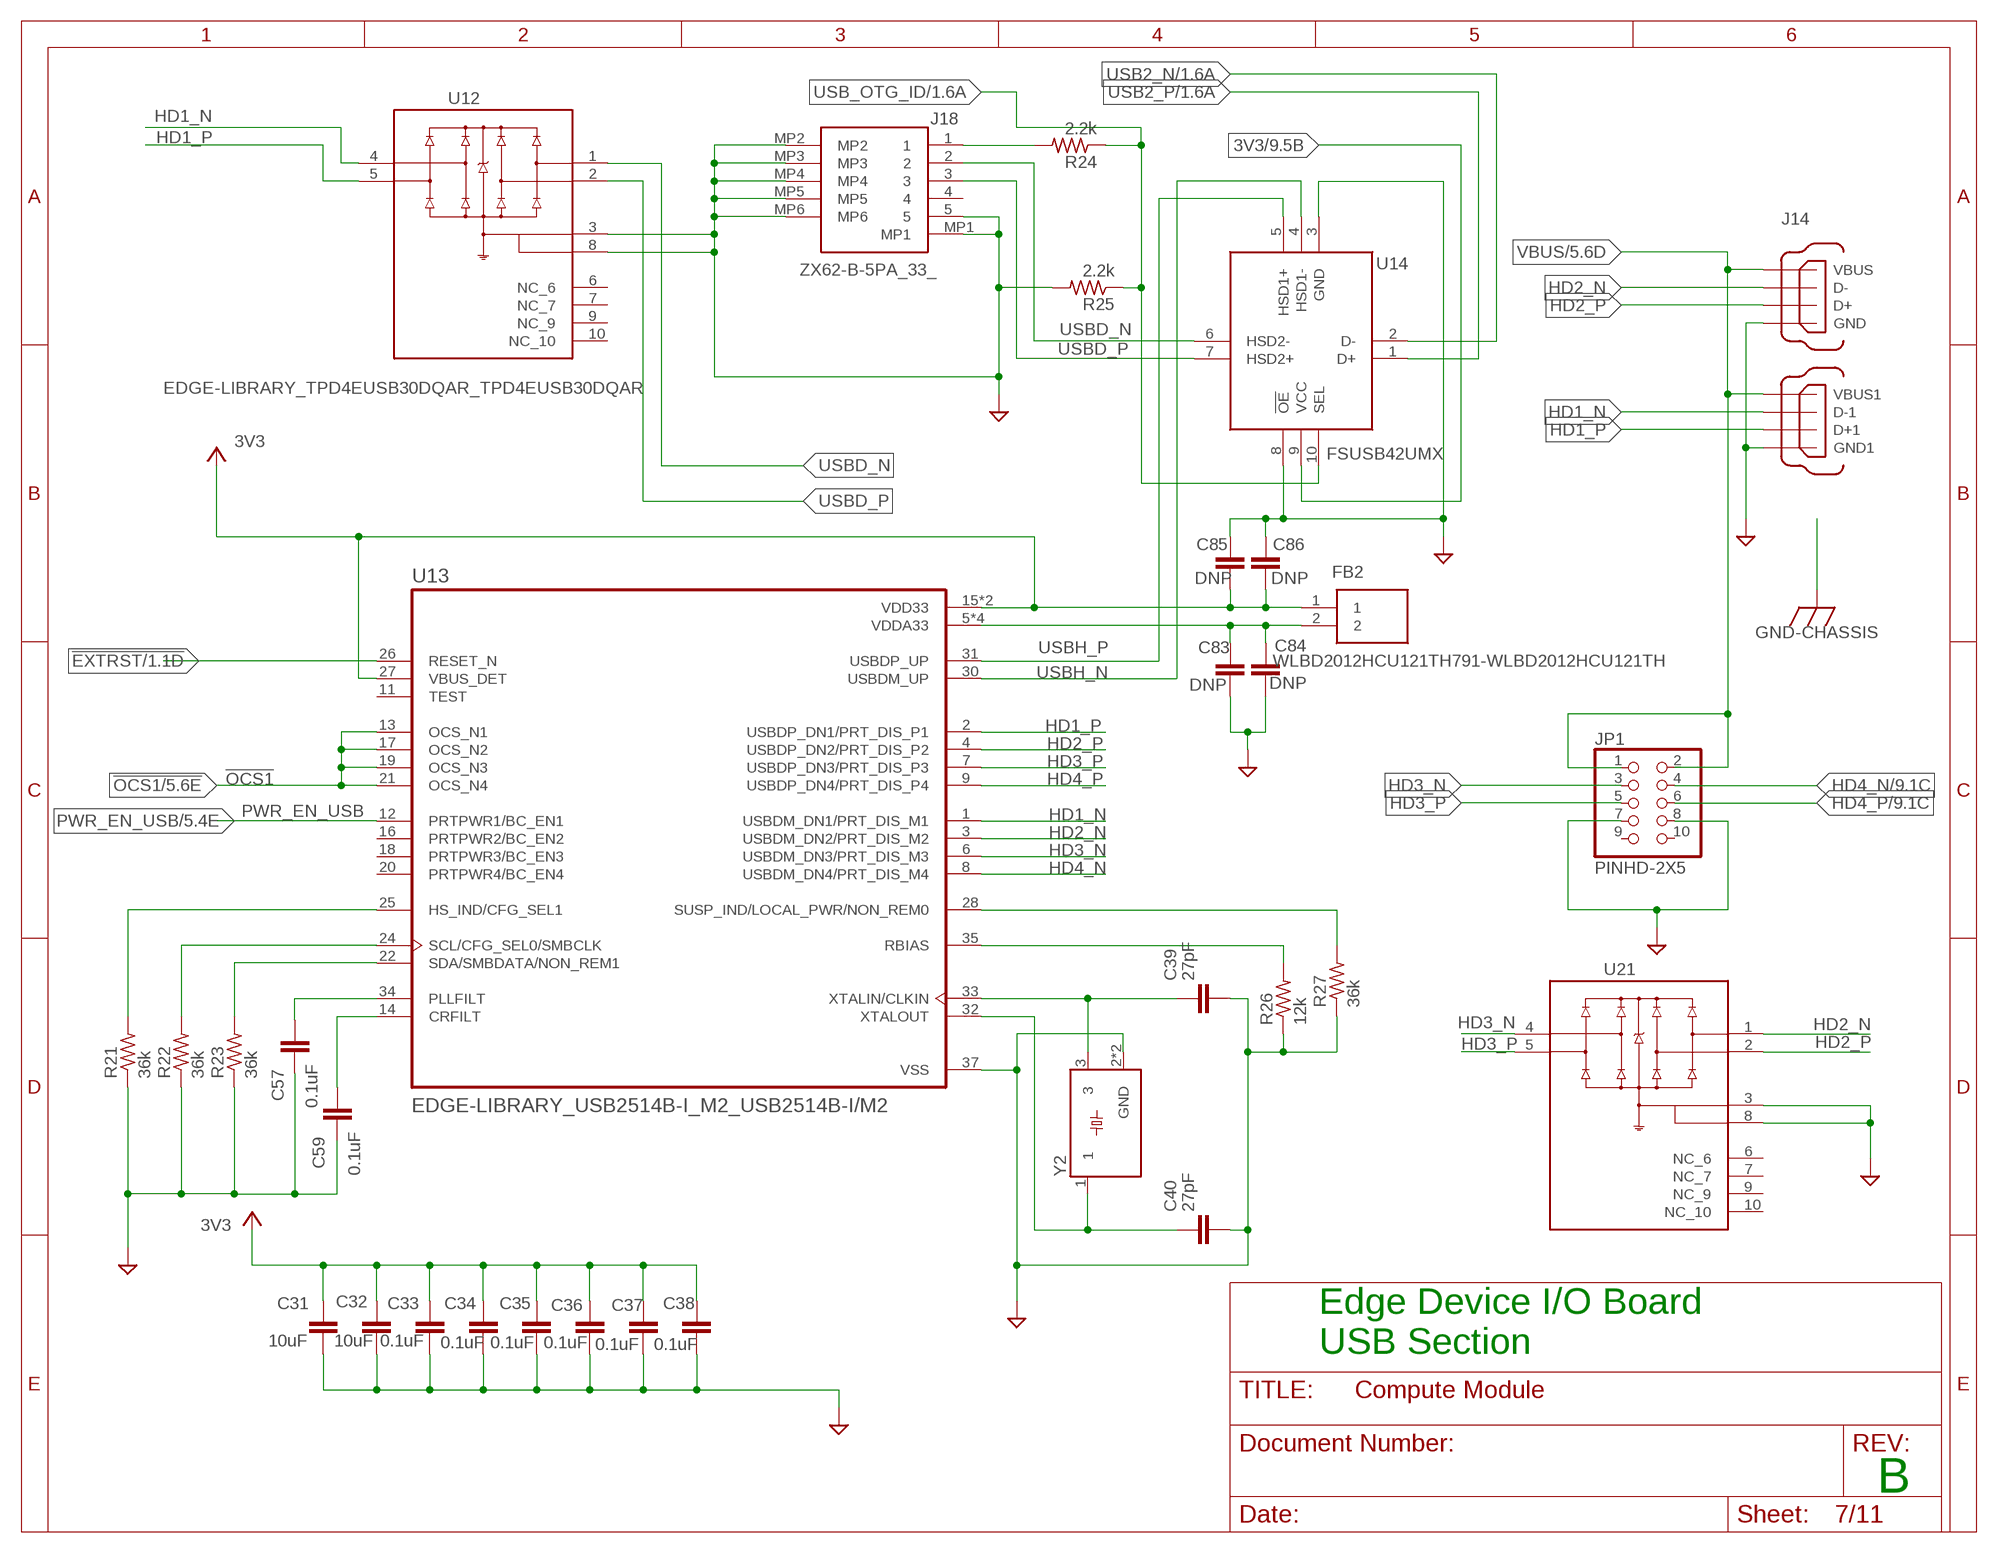
[diagram p6: schematic, sheet 7]

### Parts
C31  10uF  EDGE-LIBRARY_TUTORIAL---FUSION-360_CCHIP-0805(2012-METRIC)  [EDGE-LIBRARY_TUTORIAL---FUSION-360_CAPC2012X110]
C32  10uF  EDGE-LIBRARY_TUTORIAL---FUSION-360_CCHIP-0805(2012-METRIC)  [EDGE-LIBRARY_TUTORIAL---FUSION-360_CAPC2012X110]
C33  0.1uF  EDGE-LIBRARY_TUTORIAL---FUSION-360_CCHIP-0402(1005-METRIC)  [EDGE-LIBRARY_TUTORIAL---FUSION-360_CAPC1005X60]
C34  0.1uF  EDGE-LIBRARY_TUTORIAL---FUSION-360_CCHIP-0402(1005-METRIC)  [EDGE-LIBRARY_TUTORIAL---FUSION-360_CAPC1005X60]
C35  0.1uF  EDGE-LIBRARY_TUTORIAL---FUSION-360_CCHIP-0402(1005-METRIC)  [EDGE-LIBRARY_TUTORIAL---FUSION-360_CAPC1005X60]
C36  0.1uF  EDGE-LIBRARY_TUTORIAL---FUSION-360_CCHIP-0402(1005-METRIC)  [EDGE-LIBRARY_TUTORIAL---FUSION-360_CAPC1005X60]
C37  0.1uF  EDGE-LIBRARY_TUTORIAL---FUSION-360_CCHIP-0402(1005-METRIC)  [EDGE-LIBRARY_TUTORIAL---FUSION-360_CAPC1005X60]
C38  0.1uF  EDGE-LIBRARY_TUTORIAL---FUSION-360_CCHIP-0402(1005-METRIC)  [EDGE-LIBRARY_TUTORIAL---FUSION-360_CAPC1005X60]
C39  27pF  EDGE-LIBRARY_TUTORIAL---FUSION-360_CCHIP-0402(1005-METRIC)  [EDGE-LIBRARY_TUTORIAL---FUSION-360_CAPC1005X60]
C40  27pF  EDGE-LIBRARY_TUTORIAL---FUSION-360_CCHIP-0402(1005-METRIC)  [EDGE-LIBRARY_TUTORIAL---FUSION-360_CAPC1005X60]
C57  0.1uF  EDGE-LIBRARY_TUTORIAL---FUSION-360_CCHIP-0402(1005-METRIC)  [EDGE-LIBRARY_TUTORIAL---FUSION-360_CAPC1005X60]
C59  0.1uF  EDGE-LIBRARY_TUTORIAL---FUSION-360_CCHIP-0402(1005-METRIC)  [EDGE-LIBRARY_TUTORIAL---FUSION-360_CAPC1005X60]
C83  DNP  EDGE-LIBRARY_TUTORIAL---FUSION-360_CCHIP-0402(1005-METRIC)  [EDGE-LIBRARY_TUTORIAL---FUSION-360_CAPC1005X60]
C84  DNP  EDGE-LIBRARY_TUTORIAL---FUSION-360_CCHIP-0402(1005-METRIC)  [EDGE-LIBRARY_TUTORIAL---FUSION-360_CAPC1005X60]
C85  DNP  EDGE-LIBRARY_TUTORIAL---FUSION-360_CCHIP-0402(1005-METRIC)  [EDGE-LIBRARY_TUTORIAL---FUSION-360_CAPC1005X60]
C86  DNP  EDGE-LIBRARY_TUTORIAL---FUSION-360_CCHIP-0402(1005-METRIC)  [EDGE-LIBRARY_TUTORIAL---FUSION-360_CAPC1005X60]
FB2  WLBD2012HCU121TH791-WLBD2012HCU121TH  [EDGE-LIBRARY_0805]
J14  EDGE-LIBRARY_USB_A_2PORT_STACKED_SMA  [EDGE-LIBRARY_67298-4090_MOLEX_67298-4090]
J18  ZX62-B-5PA_33_  [ZX62B5PA33]
JP1  PINHD-2X5  [2X05]
R21  36k  EDGE-LIBRARY_TUTORIAL---FUSION-360_R-USCHIP-0402(1005-METRIC)  [EDGE-LIBRARY_TUTORIAL---FUSION-360_RESC1005X40]
R22  36k  EDGE-LIBRARY_TUTORIAL---FUSION-360_R-USCHIP-0402(1005-METRIC)  [EDGE-LIBRARY_TUTORIAL---FUSION-360_RESC1005X40]
R23  36k  EDGE-LIBRARY_TUTORIAL---FUSION-360_R-USCHIP-0402(1005-METRIC)  [EDGE-LIBRARY_TUTORIAL---FUSION-360_RESC1005X40]
R24  2.2k  EDGE-LIBRARY_TUTORIAL---FUSION-360_R-USCHIP-0402(1005-METRIC)  [EDGE-LIBRARY_TUTORIAL---FUSION-360_RESC1005X40]
R25  2.2k  EDGE-LIBRARY_TUTORIAL---FUSION-360_R-USCHIP-0402(1005-METRIC)  [EDGE-LIBRARY_TUTORIAL---FUSION-360_RESC1005X40]
R26  12k  EDGE-LIBRARY_TUTORIAL---FUSION-360_R-USCHIP-0402(1005-METRIC)  [EDGE-LIBRARY_TUTORIAL---FUSION-360_RESC1005X40]
R27  36k  EDGE-LIBRARY_TUTORIAL---FUSION-360_R-USCHIP-0402(1005-METRIC)  [EDGE-LIBRARY_TUTORIAL---FUSION-360_RESC1005X40]
U12  EDGE-LIBRARY_TPD4EUSB30DQAR_TPD4EUSB30DQAR  [EDGE-LIBRARY_TPD4EUSB30DQAR_IC_TPD4EUSB30DQAR]
U13  EDGE-LIBRARY_USB2514B-I_M2_USB2514B-I/M2  [EDGE-LIBRARY_USB2514B-I_M2_QFN50P600X600X100-37N]
U14  FSUSB42UMX  [QFN40P140X180X55-10N]
U21  EDGE-LIBRARY_TPD4EUSB30DQAR_TPD4EUSB30DQAR  [EDGE-LIBRARY_TPD4EUSB30DQAR_IC_TPD4EUSB30DQAR]
Y2  EDGE-LIBRARY_ABM8-24.000MHZ-B2-T_ABM8-24.000MHZ-B2-T  [EDGE-LIBRARY_ABM8-24.000MHZ-B2-T_OSCSC320X250X100N]

### Nets
3V3: C31.1 C32.1 C33.1 C34.1 C35.1 C36.1 C37.1 C38.1 C85.2 C86.2 FB2.1 U13.15(VDD33) U13.23(VDD33) U13.27(VBUS_DET) U14.9(VCC) ; also sheet 1,2,3,4,5,6,9,10
!EXTRST: U13.26(RESET_N) ; also sheet 1
!OCS1: U13.13(OCS_N1) U13.17(OCS_N2) U13.19(OCS_N3) U13.21(OCS_N4) ; also sheet 5
GND: C31.2 C32.2 C33.2 C34.2 C35.2 C36.2 C37.2 C38.2 C39.2 C40.2 C57.1 C59.1 C83.2 C84.2 C85.1 C86.1 J14.4(GND1) J14.8(GND) J18.5 J18.MP1 J18.MP2 J18.MP3 J18.MP4 J18.MP5 J18.MP6 JP1.7 JP1.8 R21.1 R22.1 R23.1 R25.2 R26.1 R27.1 U12.3(GND_3) U12.8(GND_8) U13.37(VSS) U14.3(GND) U14.8(!OE) U21.3(GND_3) U21.8(GND_8) Y2.2(GND) Y2.4(GND) ; supply symbol labelled SUPPLY1_GND ; also sheet 1,2,3,4,5,6,8,9,10,11
HD1_N [USB 90]: J14.2(D-1) U12.4(D2+) U13.1(USBDM_DN1/PRT_DIS_M1)
HD1_P [USB 90]: J14.3(D+1) U12.5(D2-) U13.2(USBDP_DN1/PRT_DIS_P1)
HD2_N [USB 90]: J14.6(D-) U13.3(USBDM_DN2/PRT_DIS_M2) U21.1(D1+)
HD2_P [USB 90]: J14.7(D+) U13.4(USBDP_DN2/PRT_DIS_P2) U21.2(D1-)
HD3_N [USB 90]: JP1.3 U13.6(USBDM_DN3/PRT_DIS_M3) U21.4(D2+)
HD3_P [USB 90]: JP1.5 U13.7(USBDP_DN3/PRT_DIS_P3) U21.5(D2-)
HD4_N [USB 90]: JP1.4 U13.8(USBDM_DN4/PRT_DIS_M4) ; also sheet 9
HD4_P [USB 90]: JP1.6 U13.9(USBDP_DN4/PRT_DIS_P4) ; also sheet 9
N$33: R23.2 U13.22(SDA/SMBDATA/NON_REM1)
N$34: R22.2 U13.24(SCL/CFG_SEL0/SMBCLK)
N$35: R21.2 U13.25(HS_IND/CFG_SEL1)
N$36: R27.2 U13.28(SUSP_IND/LOCAL_PWR/NON_REM0)
N$37: R26.2 U13.35(RBIAS)
N$38: C39.1 U13.33(XTALIN/CLKIN) Y2.3
N$39: C40.1 U13.32(XTALOUT) Y2.1
N$41: J18.1 R24.2
N$63: C57.2 U13.34(PLLFILT)
N$64: C59.2 U13.14(CRFILT)
N$75: C83.1 C84.1 FB2.2 U13.5(VDDA33) U13.10(VDDA33) U13.29(VDDA33) U13.36(VDDA33)
PWR_EN_USB: U13.12(PRTPWR1/BC_EN1) ; also sheet 5
USB2_N [USB 90]: U14.2(D-) ; also sheet 1
USB2_P [USB 90]: U14.1(D+) ; also sheet 1
USB_OTG_ID: R24.1 R25.1 U14.10(SEL) ; also sheet 1
USBD_N [USB 90]: J18.2 U12.1(D1+) U14.6(HSD2-)
USBD_P [USB 90]: J18.3 U12.2(D1-) U14.7(HSD2+)
USBH_N [USB 90]: U13.30(USBDM_UP) U14.4(HSD1-)
USBH_P [USB 90]: U13.31(USBDP_UP) U14.5(HSD1+)
VBUS: J14.1(VBUS1) J14.5(VBUS) JP1.1 JP1.2 ; also sheet 5
Unconnected: J18.4 JP1.9 JP1.10 U12.6(NC_6) U12.7(NC_7) U12.9(NC_9) U12.10(NC_10) U13.11(TEST) U13.16(PRTPWR2/BC_EN2) U13.18(PRTPWR3/BC_EN3) U13.20(PRTPWR4/BC_EN4) U21.6(NC_6) U21.7(NC_7) U21.9(NC_9) U21.10(NC_10)

### Notes on the sheet
- Edge Device I/O Board
  USB Section
- B

## Sheet 8 of 11
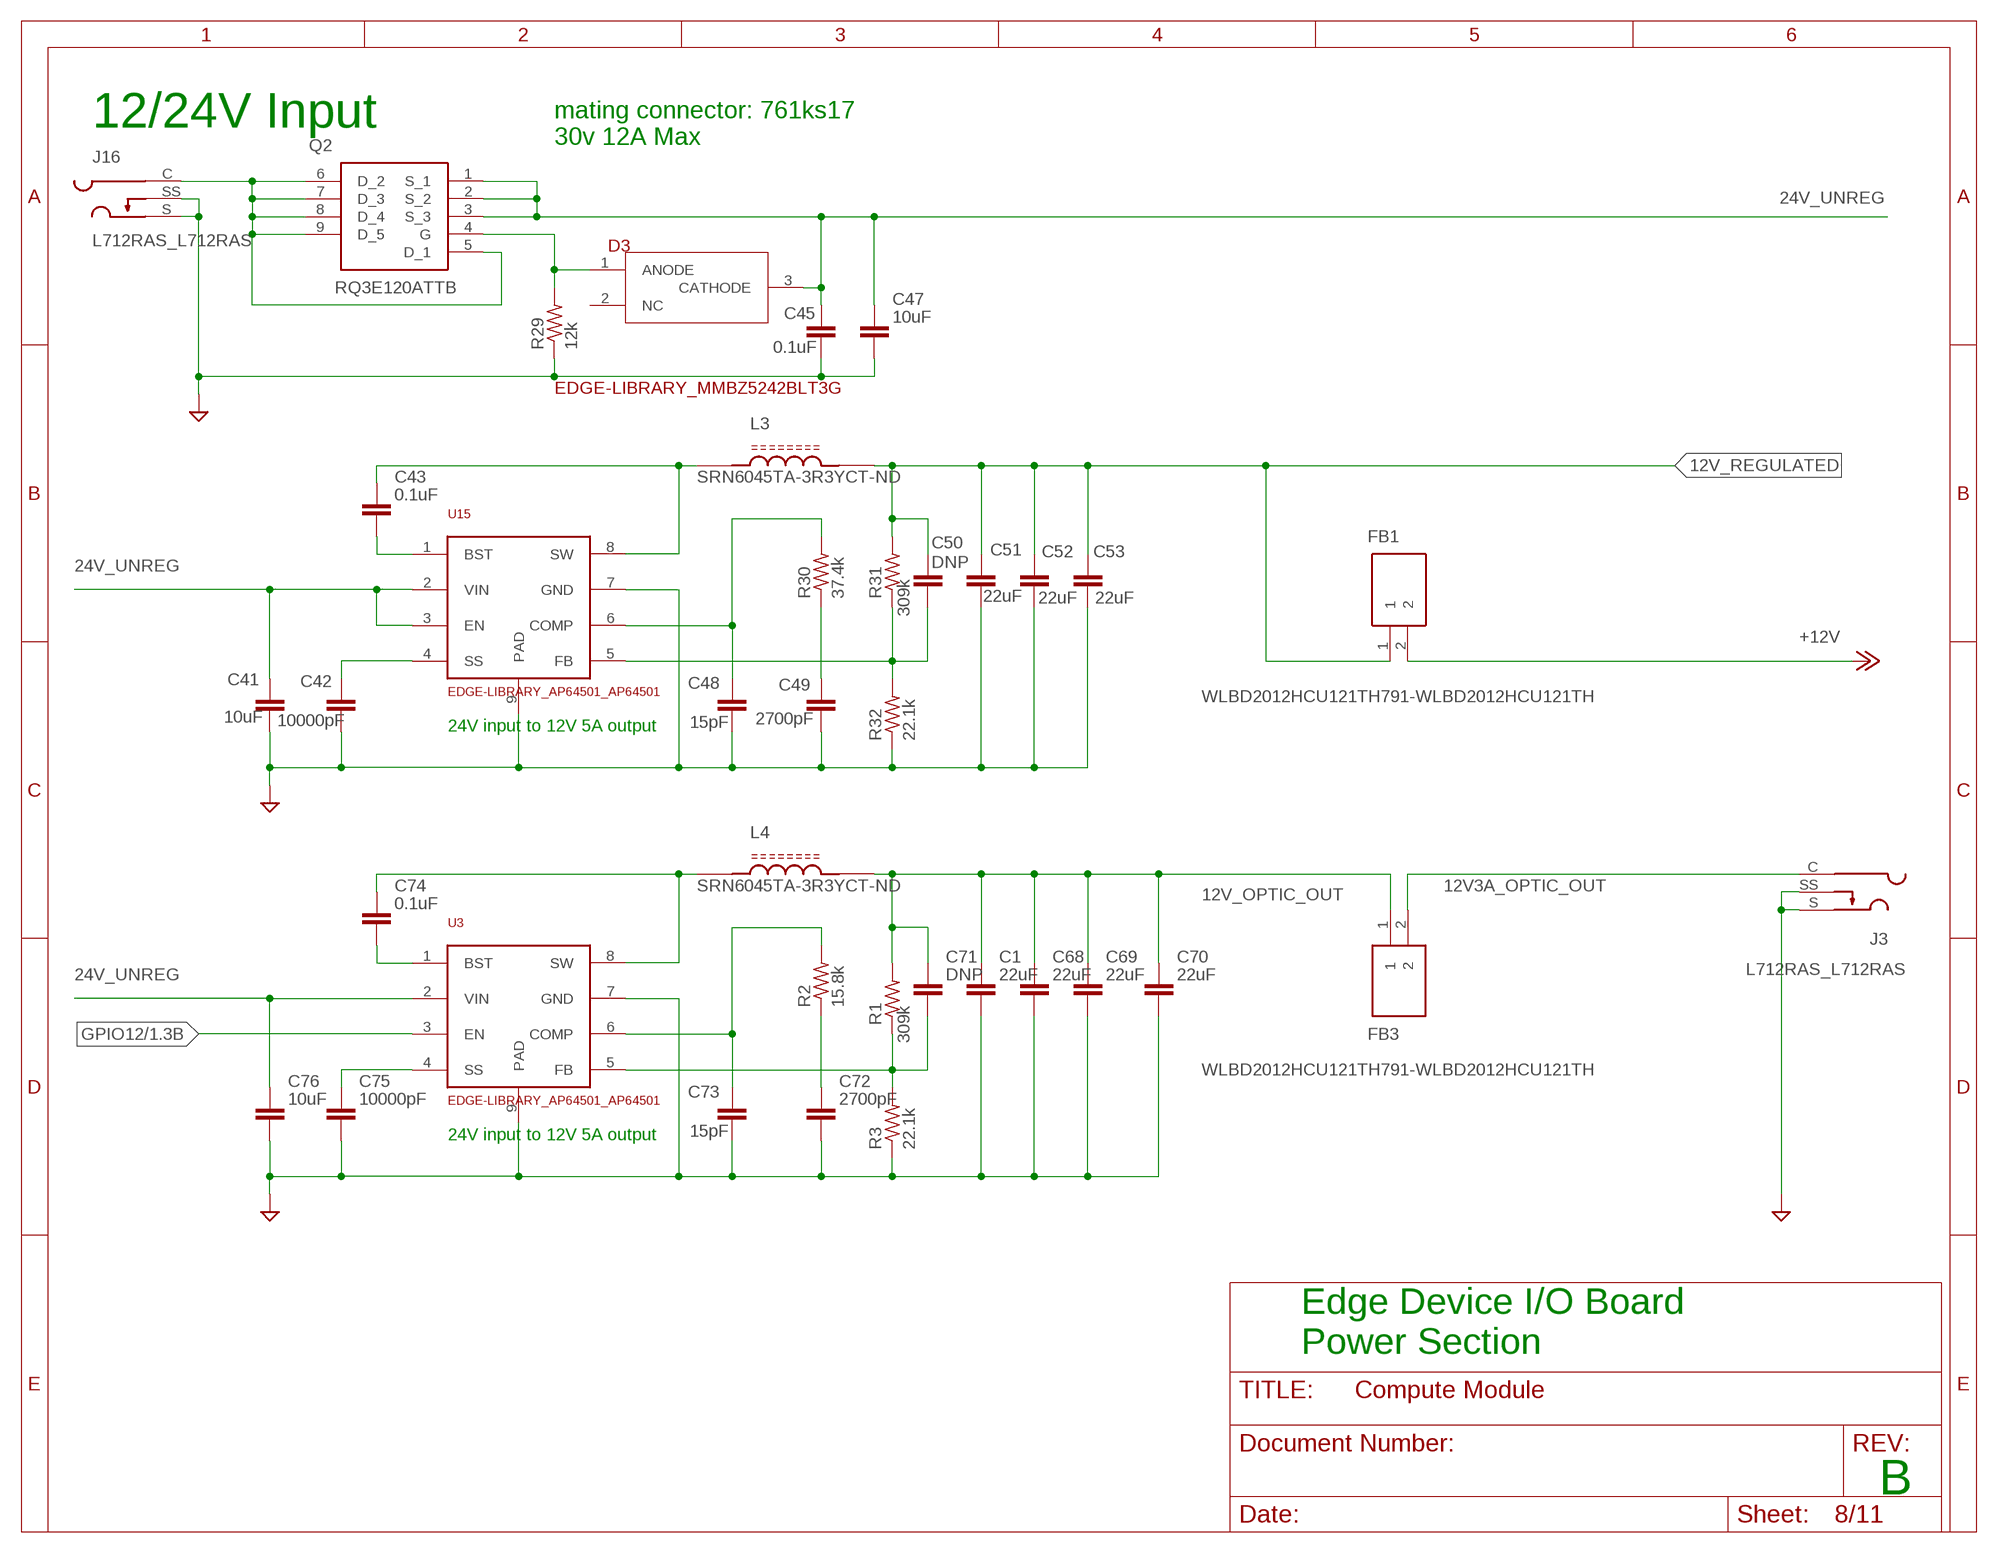
[diagram p7: schematic, sheet 8]

### Parts
C1  22uF  EDGE-LIBRARY_TUTORIAL---FUSION-360_CCHIP-0402(1005-METRIC)  [EDGE-LIBRARY_TUTORIAL---FUSION-360_CAPC1005X60]
C41  10uF  EDGE-LIBRARY_TUTORIAL---FUSION-360_CCHIP-0805(2012-METRIC)  [EDGE-LIBRARY_TUTORIAL---FUSION-360_CAPC2012X110]
C42  10000pF  EDGE-LIBRARY_TUTORIAL---FUSION-360_CCHIP-0402(1005-METRIC)  [EDGE-LIBRARY_TUTORIAL---FUSION-360_CAPC1005X60]
C43  0.1uF  EDGE-LIBRARY_TUTORIAL---FUSION-360_CCHIP-0402(1005-METRIC)  [EDGE-LIBRARY_TUTORIAL---FUSION-360_CAPC1005X60]
C45  0.1uF  EDGE-LIBRARY_TUTORIAL---FUSION-360_CCHIP-0402(1005-METRIC)  [EDGE-LIBRARY_TUTORIAL---FUSION-360_CAPC1005X60]
C47  10uF  EDGE-LIBRARY_TUTORIAL---FUSION-360_CCHIP-0805(2012-METRIC)  [EDGE-LIBRARY_TUTORIAL---FUSION-360_CAPC2012X110]
C48  15pF  EDGE-LIBRARY_TUTORIAL---FUSION-360_CCHIP-0402(1005-METRIC)  [EDGE-LIBRARY_TUTORIAL---FUSION-360_CAPC1005X60]
C49  2700pF  EDGE-LIBRARY_TUTORIAL---FUSION-360_CCHIP-0402(1005-METRIC)  [EDGE-LIBRARY_TUTORIAL---FUSION-360_CAPC1005X60]
C50  DNP  EDGE-LIBRARY_TUTORIAL---FUSION-360_CCHIP-0402(1005-METRIC)  [EDGE-LIBRARY_TUTORIAL---FUSION-360_CAPC1005X60]
C51  22uF  EDGE-LIBRARY_TUTORIAL---FUSION-360_CCHIP-0402(1005-METRIC)  [EDGE-LIBRARY_TUTORIAL---FUSION-360_CAPC1005X60]
C52  22uF  EDGE-LIBRARY_TUTORIAL---FUSION-360_CCHIP-0402(1005-METRIC)  [EDGE-LIBRARY_TUTORIAL---FUSION-360_CAPC1005X60]
C53  22uF  EDGE-LIBRARY_TUTORIAL---FUSION-360_CCHIP-0402(1005-METRIC)  [EDGE-LIBRARY_TUTORIAL---FUSION-360_CAPC1005X60]
C68  22uF  EDGE-LIBRARY_TUTORIAL---FUSION-360_CCHIP-0402(1005-METRIC)  [EDGE-LIBRARY_TUTORIAL---FUSION-360_CAPC1005X60]
C69  22uF  EDGE-LIBRARY_TUTORIAL---FUSION-360_CCHIP-0402(1005-METRIC)  [EDGE-LIBRARY_TUTORIAL---FUSION-360_CAPC1005X60]
C70  22uF  EDGE-LIBRARY_TUTORIAL---FUSION-360_CCHIP-0402(1005-METRIC)  [EDGE-LIBRARY_TUTORIAL---FUSION-360_CAPC1005X60]
C71  DNP  EDGE-LIBRARY_TUTORIAL---FUSION-360_CCHIP-0402(1005-METRIC)  [EDGE-LIBRARY_TUTORIAL---FUSION-360_CAPC1005X60]
C72  2700pF  EDGE-LIBRARY_TUTORIAL---FUSION-360_CCHIP-0402(1005-METRIC)  [EDGE-LIBRARY_TUTORIAL---FUSION-360_CAPC1005X60]
C73  15pF  EDGE-LIBRARY_TUTORIAL---FUSION-360_CCHIP-0402(1005-METRIC)  [EDGE-LIBRARY_TUTORIAL---FUSION-360_CAPC1005X60]
C74  0.1uF  EDGE-LIBRARY_TUTORIAL---FUSION-360_CCHIP-0402(1005-METRIC)  [EDGE-LIBRARY_TUTORIAL---FUSION-360_CAPC1005X60]
C75  10000pF  EDGE-LIBRARY_TUTORIAL---FUSION-360_CCHIP-0402(1005-METRIC)  [EDGE-LIBRARY_TUTORIAL---FUSION-360_CAPC1005X60]
C76  10uF  EDGE-LIBRARY_TUTORIAL---FUSION-360_CCHIP-0805(2012-METRIC)  [EDGE-LIBRARY_TUTORIAL---FUSION-360_CAPC2012X110]
D3  EDGE-LIBRARY_MMBZ5242BLT3G  [EDGE-LIBRARY_SOT23]
FB1  WLBD2012HCU121TH791-WLBD2012HCU121TH  [EDGE-LIBRARY_0805]
FB3  WLBD2012HCU121TH791-WLBD2012HCU121TH  [EDGE-LIBRARY_0805]
J3  L712RAS_L712RAS  [L712RAS_SWITCHCRAFT_L712RAS]
J16  L712RAS_L712RAS  [L712RAS_SWITCHCRAFT_L712RAS]
L3  EDGE-LIBRARY_SRN6045TA-3R3Y_SRN6045TA-3R3Y  [EDGE-LIBRARY_SRN6045TA-3R3Y_IND_SRN6045TA-3R3Y]
L4  EDGE-LIBRARY_SRN6045TA-3R3Y_SRN6045TA-3R3Y  [EDGE-LIBRARY_SRN6045TA-3R3Y_IND_SRN6045TA-3R3Y]
Q2  RQ3E120ATTB  [RQ3E100ATTB]
R1  309k  EDGE-LIBRARY_TUTORIAL---FUSION-360_R-USCHIP-0402(1005-METRIC)  [EDGE-LIBRARY_TUTORIAL---FUSION-360_RESC1005X40]
R2  15.8k  EDGE-LIBRARY_TUTORIAL---FUSION-360_R-USCHIP-0402(1005-METRIC)  [EDGE-LIBRARY_TUTORIAL---FUSION-360_RESC1005X40]
R3  22.1k  EDGE-LIBRARY_TUTORIAL---FUSION-360_R-USCHIP-0402(1005-METRIC)  [EDGE-LIBRARY_TUTORIAL---FUSION-360_RESC1005X40]
R29  12k  EDGE-LIBRARY_TUTORIAL---FUSION-360_R-USCHIP-0402(1005-METRIC)  [EDGE-LIBRARY_TUTORIAL---FUSION-360_RESC1005X40]
R30  37.4k  EDGE-LIBRARY_TUTORIAL---FUSION-360_R-USCHIP-0402(1005-METRIC)  [EDGE-LIBRARY_TUTORIAL---FUSION-360_RESC1005X40]
R31  309k  EDGE-LIBRARY_TUTORIAL---FUSION-360_R-USCHIP-0402(1005-METRIC)  [EDGE-LIBRARY_TUTORIAL---FUSION-360_RESC1005X40]
R32  22.1k  EDGE-LIBRARY_TUTORIAL---FUSION-360_R-USCHIP-0402(1005-METRIC)  [EDGE-LIBRARY_TUTORIAL---FUSION-360_RESC1005X40]
U3  EDGE-LIBRARY_AP64501_AP64501  [EDGE-LIBRARY_AP64501_SOIC127P600X265-9T261X350N]
U15  EDGE-LIBRARY_AP64501_AP64501  [EDGE-LIBRARY_AP64501_SOIC127P600X265-9T261X350N]

### Nets
12V3A_OPTIC_OUT: FB3.2 J3.C(CENTRE_PIN)
12V_OPTIC_OUT: C1.1 C68.1 C69.1 C70.1 C71.1 FB3.1 L4.2 R1.2 ; also sheet 6
12V_REGULATED: C50.1 C51.1 C52.1 C53.1 FB1.1 L3.2 R31.2
24V_UNREG: C41.1 C45.1 C47.1 C76.1 D3.3(CATHODE) Q2.1(S_1) Q2.2(S_2) Q2.3(S_3) U3.2(VIN) U15.2(VIN) U15.3(EN)
+12V: FB1.2 ; also sheet 4,5,11
GND: C1.2 C41.2 C42.2 C45.2 C47.2 C48.2 C49.2 C51.2 C52.2 C53.2 C68.2 C69.2 C70.2 C72.2 C73.2 C75.2 C76.2 J3.S(SLEEVE) J3.SS(SLEEVE_SHUNT) J16.S(SLEEVE) J16.SS(SLEEVE_SHUNT) R3.1 R29.1 R32.1 U3.7(GND) U3.9(PAD) U15.7(GND) U15.9(PAD) ; supply symbol labelled SUPPLY1_GND ; also sheet 1,2,3,4,5,6,7,9,10,11
GPIO12: U3.3(EN) ; also sheet 1,3
N$2: C43.2 U15.1(BST)
N$5: C74.2 U3.1(BST)
N$6: C74.1 L4.1 U3.8(SW)
N$8: C75.1 U3.4(SS)
N$13: C73.1 R2.2 U3.6(COMP)
N$22: C72.1 R2.1
N$40: C71.2 R1.1 R3.2 U3.5(FB)
N$42: C43.1 L3.1 U15.8(SW)
N$55: C42.1 U15.4(SS)
N$56: C48.1 R30.2 U15.6(COMP)
N$57: C49.1 R30.1
N$58: C50.2 R31.1 R32.2 U15.5(FB)
N$59: J16.C(CENTRE_PIN) Q2.5(D_1) Q2.6(D_2) Q2.7(D_3) Q2.8(D_4) Q2.9(D_5)
N$68: D3.1(ANODE) Q2.4(G) R29.2
Unconnected: D3.2(NC)

### Notes on the sheet
- 12/24V Input
- mating connector: 761ks17
  30v 12A Max
- 24V input to 12V 5A output
- 24V input to 12V 5A output
- Edge Device I/O Board
  Power Section
- B

## Sheet 9 of 11
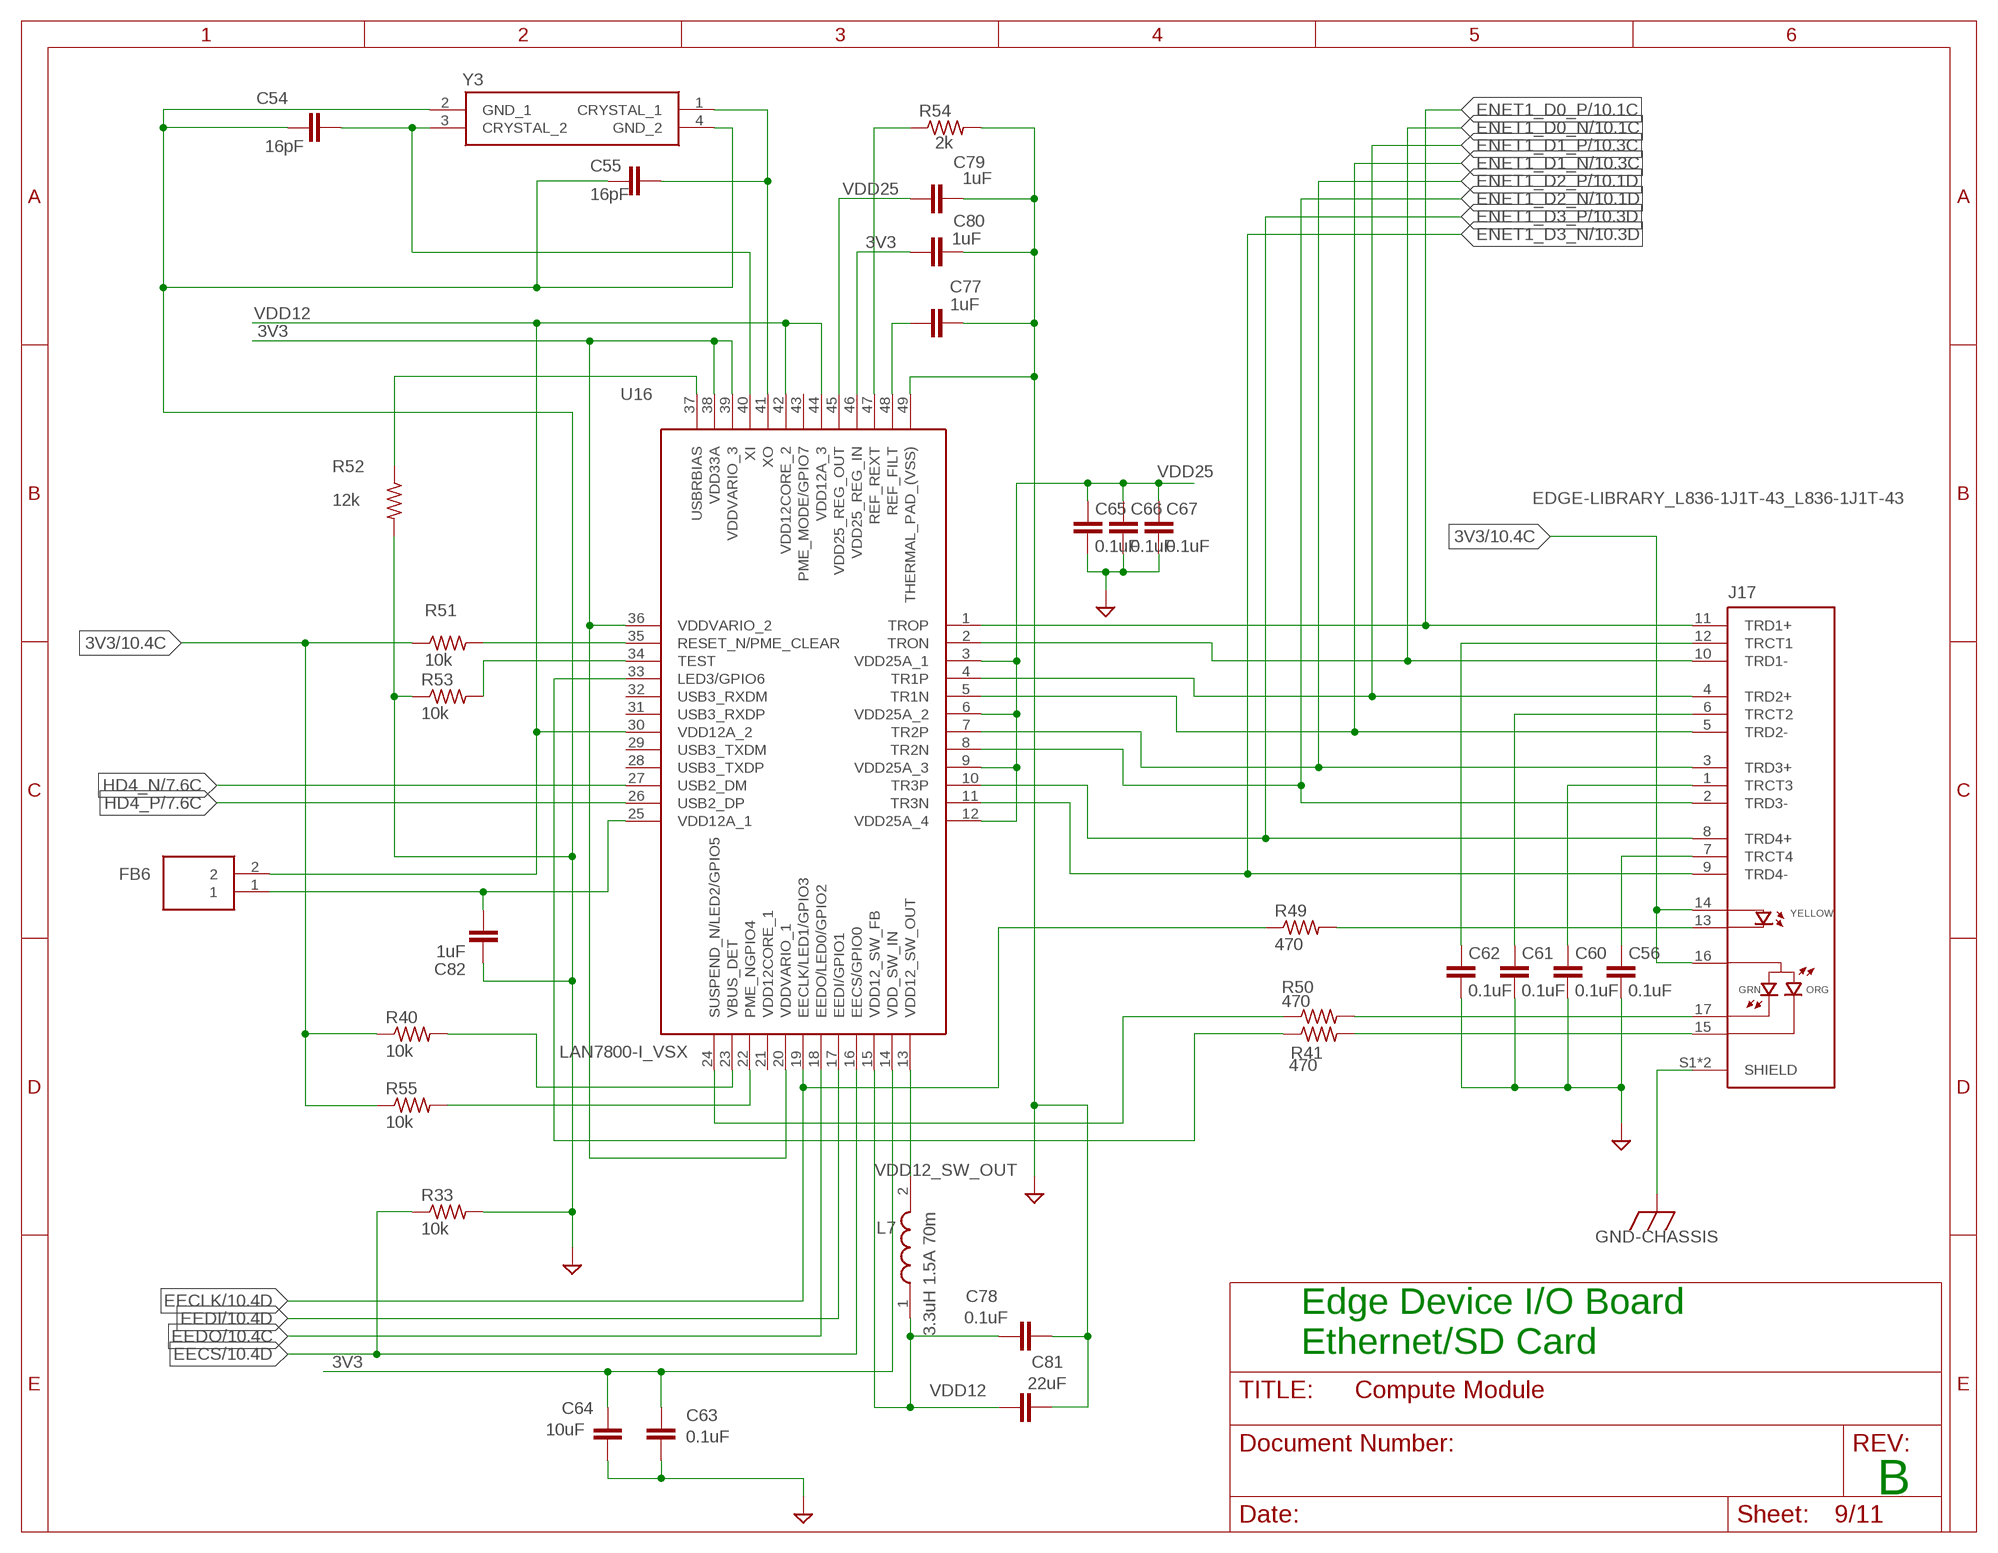
[diagram p8: schematic, sheet 9]

### Parts
C54  16pF  EDGE-LIBRARY_TUTORIAL---FUSION-360_CCHIP-0402(1005-METRIC)  [EDGE-LIBRARY_TUTORIAL---FUSION-360_CAPC1005X60]
C55  16pF  EDGE-LIBRARY_TUTORIAL---FUSION-360_CCHIP-0402(1005-METRIC)  [EDGE-LIBRARY_TUTORIAL---FUSION-360_CAPC1005X60]
C56  0.1uF  EDGE-LIBRARY_TUTORIAL---FUSION-360_CCHIP-0402(1005-METRIC)  [EDGE-LIBRARY_TUTORIAL---FUSION-360_CAPC1005X60]
C60  0.1uF  EDGE-LIBRARY_TUTORIAL---FUSION-360_CCHIP-0402(1005-METRIC)  [EDGE-LIBRARY_TUTORIAL---FUSION-360_CAPC1005X60]
C61  0.1uF  EDGE-LIBRARY_TUTORIAL---FUSION-360_CCHIP-0402(1005-METRIC)  [EDGE-LIBRARY_TUTORIAL---FUSION-360_CAPC1005X60]
C62  0.1uF  EDGE-LIBRARY_TUTORIAL---FUSION-360_CCHIP-0402(1005-METRIC)  [EDGE-LIBRARY_TUTORIAL---FUSION-360_CAPC1005X60]
C63  0.1uF  EDGE-LIBRARY_TUTORIAL---FUSION-360_CCHIP-0402(1005-METRIC)  [EDGE-LIBRARY_TUTORIAL---FUSION-360_CAPC1005X60]
C64  10uF  EDGE-LIBRARY_TUTORIAL---FUSION-360_CCHIP-0805(2012-METRIC)  [EDGE-LIBRARY_TUTORIAL---FUSION-360_CAPC2012X110]
C65  0.1uF  EDGE-LIBRARY_TUTORIAL---FUSION-360_CCHIP-0402(1005-METRIC)  [EDGE-LIBRARY_TUTORIAL---FUSION-360_CAPC1005X60]
C66  0.1uF  EDGE-LIBRARY_TUTORIAL---FUSION-360_CCHIP-0402(1005-METRIC)  [EDGE-LIBRARY_TUTORIAL---FUSION-360_CAPC1005X60]
C67  0.1uF  EDGE-LIBRARY_TUTORIAL---FUSION-360_CCHIP-0402(1005-METRIC)  [EDGE-LIBRARY_TUTORIAL---FUSION-360_CAPC1005X60]
C77  1uF  EDGE-LIBRARY_TUTORIAL---FUSION-360_CCHIP-0402(1005-METRIC)  [EDGE-LIBRARY_TUTORIAL---FUSION-360_CAPC1005X60]
C78  0.1uF  EDGE-LIBRARY_TUTORIAL---FUSION-360_CCHIP-0402(1005-METRIC)  [EDGE-LIBRARY_TUTORIAL---FUSION-360_CAPC1005X60]
C79  1uF  EDGE-LIBRARY_TUTORIAL---FUSION-360_CCHIP-0402(1005-METRIC)  [EDGE-LIBRARY_TUTORIAL---FUSION-360_CAPC1005X60]
C80  1uF  EDGE-LIBRARY_TUTORIAL---FUSION-360_CCHIP-0402(1005-METRIC)  [EDGE-LIBRARY_TUTORIAL---FUSION-360_CAPC1005X60]
C81  22uF  EDGE-LIBRARY_TUTORIAL---FUSION-360_CCHIP-0402(1005-METRIC)  [EDGE-LIBRARY_TUTORIAL---FUSION-360_CAPC1005X60]
C82  1uF  EDGE-LIBRARY_TUTORIAL---FUSION-360_CCHIP-0402(1005-METRIC)  [EDGE-LIBRARY_TUTORIAL---FUSION-360_CAPC1005X60]
FB6  SAMACSYS_PARTS_BLM18PG121SN1D  [SAMACSYS_PARTS_BLM18AG102BH1D]
J17  EDGE-LIBRARY_L836-1J1T-43_L836-1J1T-43  [EDGE-LIBRARY_L836-1J1T-43_BEL_L836-1J1T-43]
L7  3.3uH 1.5A 70m  74404032033  [INDPM3030X150N]
R33  10k  EDGE-LIBRARY_TUTORIAL---FUSION-360_R-USCHIP-0402(1005-METRIC)  [EDGE-LIBRARY_TUTORIAL---FUSION-360_RESC1005X40]
R40  10k  EDGE-LIBRARY_TUTORIAL---FUSION-360_R-USCHIP-0402(1005-METRIC)  [EDGE-LIBRARY_TUTORIAL---FUSION-360_RESC1005X40]
R41  470  EDGE-LIBRARY_TUTORIAL---FUSION-360_R-USCHIP-0402(1005-METRIC)  [EDGE-LIBRARY_TUTORIAL---FUSION-360_RESC1005X40]
R49  470  EDGE-LIBRARY_TUTORIAL---FUSION-360_R-USCHIP-0402(1005-METRIC)  [EDGE-LIBRARY_TUTORIAL---FUSION-360_RESC1005X40]
R50  470  EDGE-LIBRARY_TUTORIAL---FUSION-360_R-USCHIP-0402(1005-METRIC)  [EDGE-LIBRARY_TUTORIAL---FUSION-360_RESC1005X40]
R51  10k  EDGE-LIBRARY_TUTORIAL---FUSION-360_R-USCHIP-0402(1005-METRIC)  [EDGE-LIBRARY_TUTORIAL---FUSION-360_RESC1005X40]
R52  12k  EDGE-LIBRARY_TUTORIAL---FUSION-360_R-USCHIP-0402(1005-METRIC)  [EDGE-LIBRARY_TUTORIAL---FUSION-360_RESC1005X40]
R53  10k  EDGE-LIBRARY_TUTORIAL---FUSION-360_R-USCHIP-0402(1005-METRIC)  [EDGE-LIBRARY_TUTORIAL---FUSION-360_RESC1005X40]
R54  2k  EDGE-LIBRARY_TUTORIAL---FUSION-360_R-USCHIP-0402(1005-METRIC)  [EDGE-LIBRARY_TUTORIAL---FUSION-360_RESC1005X40]
R55  10k  EDGE-LIBRARY_TUTORIAL---FUSION-360_R-USCHIP-0402(1005-METRIC)  [EDGE-LIBRARY_TUTORIAL---FUSION-360_RESC1005X40]
U16  LAN7800-I_VSX  [QFN40P600X600X90-49N]
Y3  SAMACSYS_PARTS_ABM8G-25.000MHZ-B4Y-T3  [SAMACSYS_PARTS_ABM8G48000MHZ18D2YT]

### Nets
3V3: C63.1 C64.1 C80.1 J17.14 J17.16 R40.1 R51.1 R55.1 U16.14(VDD_SW_IN) U16.20(VDDVARIO_1) U16.36(VDDVARIO_2) U16.38(VDD33A) U16.39(VDDVARIO_3) U16.46(VDD25_REG_IN) ; also sheet 1,2,3,4,5,6,7,10
CGND: J17.S1(SHIELD) J17.S2(SHIELD) ; supply symbol labelled GND-CHASSIS ; also sheet 2,3,4,7
EECLK: R49.1 U16.19(EECLK/LED1/GPIO3) ; also sheet 10
EECS: R33.1 U16.16(EECS/GPIO0) ; also sheet 10
EEDI: U16.17(EEDI/GPIO1) ; also sheet 10
EEDO: U16.18(EEDO/LED0/GPIO2) ; also sheet 10
ENET1_D0_N [Ethernet 100]: J17.10(TRD1-) U16.2(TRON) ; also sheet 10
ENET1_D0_P [Ethernet 100]: J17.11(TRD1+) U16.1(TROP) ; also sheet 10
ENET1_D1_N [Ethernet 100]: J17.5(TRD2-) U16.5(TR1N) ; also sheet 10
ENET1_D1_P [Ethernet 100]: J17.4(TRD2+) U16.4(TR1P) ; also sheet 10
ENET1_D2_N [Ethernet 100]: J17.2(TRD3-) U16.8(TR2N) ; also sheet 10
ENET1_D2_P [Ethernet 100]: J17.3(TRD3+) U16.7(TR2P) ; also sheet 10
ENET1_D3_N [Ethernet 100]: J17.9(TRD4-) U16.11(TR3N) ; also sheet 10
ENET1_D3_P [Ethernet 100]: J17.8(TRD4+) U16.10(TR3P) ; also sheet 10
GND: C54.1 C55.2 C56.2 C60.2 C61.2 C62.2 C63.2 C64.2 C65.2 C66.2 C67.2 C77.2 C78.2 C79.2 C80.2 C81.2 C82.1 R33.2 R52.2 R53.1 R54.2 U16.49(THERMAL_PAD_(VSS)) Y3.2(GND_1) Y3.4(GND_2) ; supply symbol labelled SUPPLY1_GND ; also sheet 1,2,3,4,5,6,7,8,10,11
HD4_N [USB 90]: U16.27(USB2_DM) ; also sheet 7
HD4_P [USB 90]: U16.26(USB2_DP) ; also sheet 7
N$46: J17.13 R49.2
N$47: J17.17 R50.2
N$50: J17.15 R41.2
N$51: R40.2 U16.23(VBUS_DET)
N$52: R51.2 U16.35(RESET_N/PME_CLEAR)
N$61: C54.2 U16.40(XI) Y3.3(CRYSTAL_2)
N$62: C55.1 U16.41(XO) Y3.1(CRYSTAL_1)
N$65: R52.1 U16.37(USBRBIAS)
N$66: R53.2 U16.34(TEST)
N$67: R54.1 U16.47(REF_REXT)
N$69: C77.1 U16.48(REF_FILT)
N$70: R55.2 U16.22(PME_NGPIO4)
N$71: C82.2 FB6.1 U16.25(VDD12A_1)
N$72: C62.1 J17.12(TRCT1)
N$73: C61.1 J17.6(TRCT2)
N$74: C60.1 J17.1(TRCT3)
N$76: C56.1 J17.7(TRCT4)
N$85: R50.1 U16.24(SUSPEND_N/LED2/GPIO5)
N$86: R41.1 U16.33(LED3/GPIO6)
VDD12: C78.1 C81.1 FB6.2 L7.1 U16.15(VDD12_SW_FB) U16.30(VDD12A_2) U16.42(VDD12CORE_2) U16.44(VDD12A_3)
VDD12_SW_OUT: L7.2 U16.13(VDD12_SW_OUT)
VDD25: C65.1 C66.1 C67.1 C79.1 U16.3(VDD25A_1) U16.6(VDD25A_2) U16.9(VDD25A_3) U16.12(VDD25A_4) U16.45(VDD25_REG_OUT)
Unconnected: U16.21(VDD12CORE_1) U16.28(USB3_TXDP) U16.29(USB3_TXDM) U16.31(USB3_RXDP) U16.32(USB3_RXDM) U16.43(PME_MODE/GPIO7)

### Notes on the sheet
- Edge Device I/O Board
  Ethernet/SD Card
- B

## Sheet 10 of 11
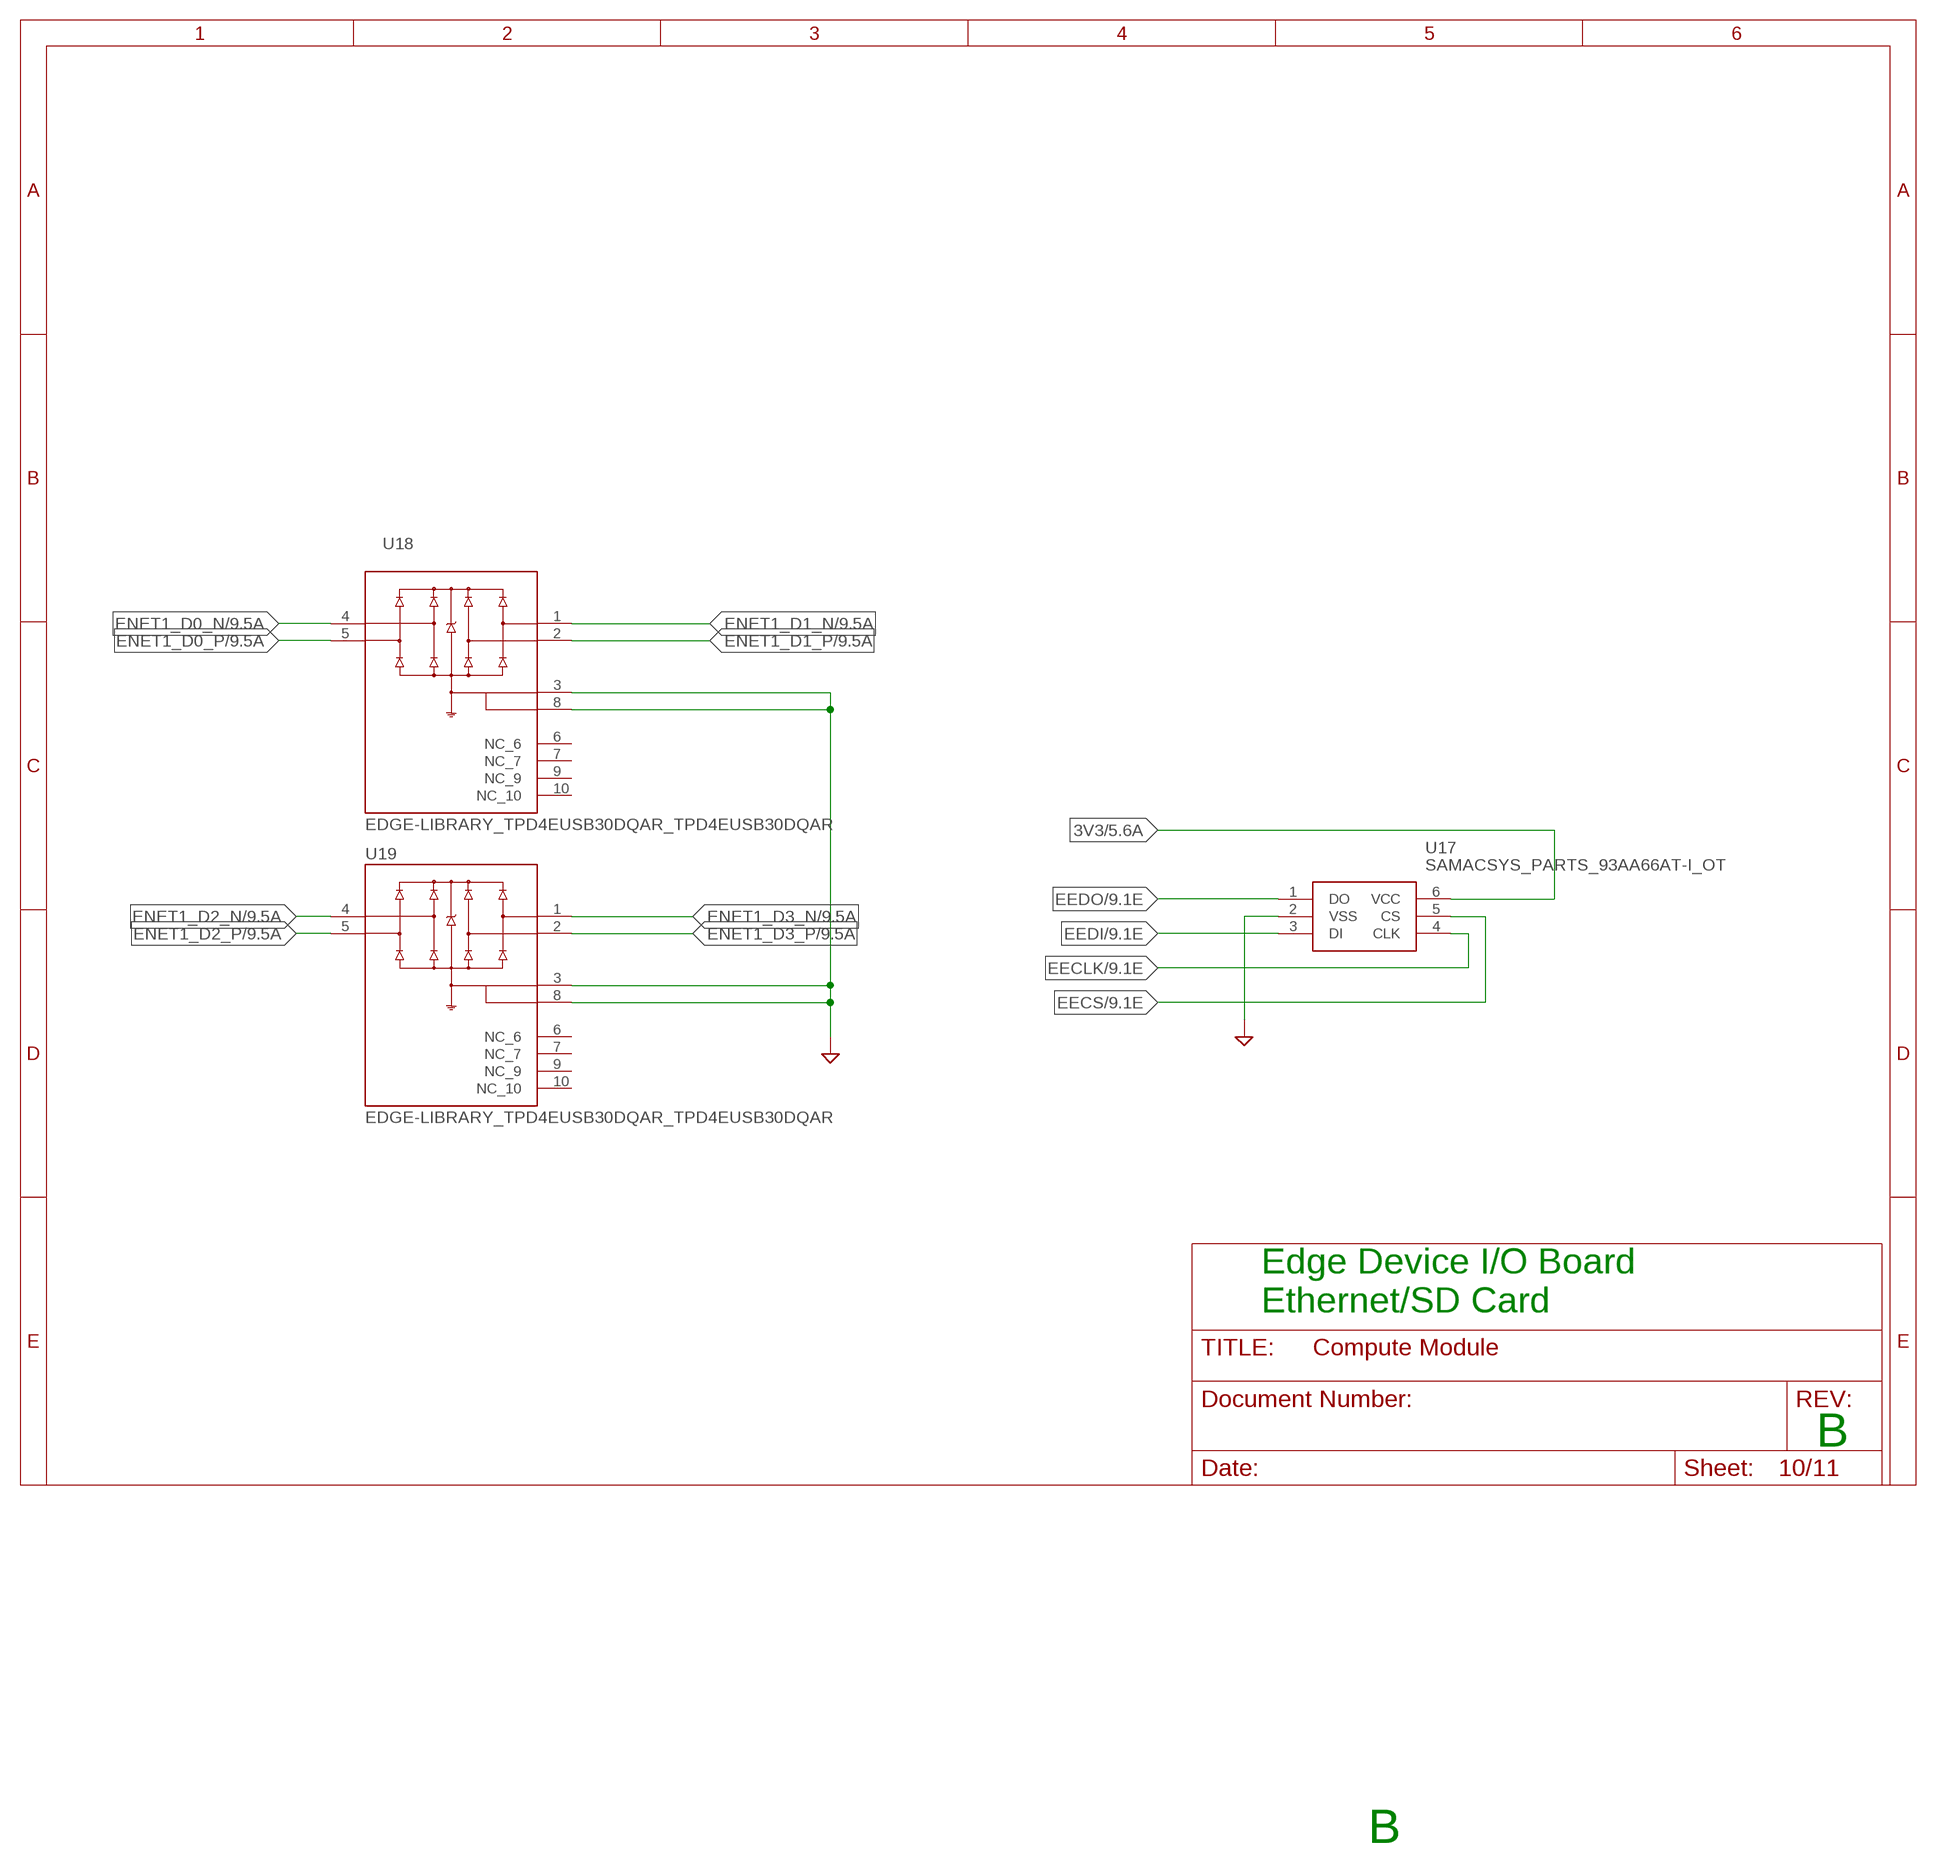
[diagram p9: schematic, sheet 10]

### Parts
U17  SAMACSYS_PARTS_93AA66AT-I_OT  [SAMACSYS_PARTS_SOT95P270X145-6N]
U18  EDGE-LIBRARY_TPD4EUSB30DQAR_TPD4EUSB30DQAR  [EDGE-LIBRARY_TPD4EUSB30DQAR_IC_TPD4EUSB30DQAR]
U19  EDGE-LIBRARY_TPD4EUSB30DQAR_TPD4EUSB30DQAR  [EDGE-LIBRARY_TPD4EUSB30DQAR_IC_TPD4EUSB30DQAR]

### Nets
3V3: U17.6(VCC) ; also sheet 1,2,3,4,5,6,7,9
EECLK: U17.4(CLK) ; also sheet 9
EECS: U17.5(CS) ; also sheet 9
EEDI: U17.3(DI) ; also sheet 9
EEDO: U17.1(DO) ; also sheet 9
ENET1_D0_N [Ethernet 100]: U18.4(D2+) ; also sheet 9
ENET1_D0_P [Ethernet 100]: U18.5(D2-) ; also sheet 9
ENET1_D1_N [Ethernet 100]: U18.1(D1+) ; also sheet 9
ENET1_D1_P [Ethernet 100]: U18.2(D1-) ; also sheet 9
ENET1_D2_N [Ethernet 100]: U19.4(D2+) ; also sheet 9
ENET1_D2_P [Ethernet 100]: U19.5(D2-) ; also sheet 9
ENET1_D3_N [Ethernet 100]: U19.1(D1+) ; also sheet 9
ENET1_D3_P [Ethernet 100]: U19.2(D1-) ; also sheet 9
GND: U17.2(VSS) U18.3(GND_3) U18.8(GND_8) U19.3(GND_3) U19.8(GND_8) ; supply symbol labelled SUPPLY1_GND ; also sheet 1,2,3,4,5,6,7,8,9,11
Unconnected: U18.6(NC_6) U18.7(NC_7) U18.9(NC_9) U18.10(NC_10) U19.6(NC_6) U19.7(NC_7) U19.9(NC_9) U19.10(NC_10)

### Notes on the sheet
- Edge Device I/O Board
  Ethernet/SD Card
- B
- B | B

## Sheet 11 of 11
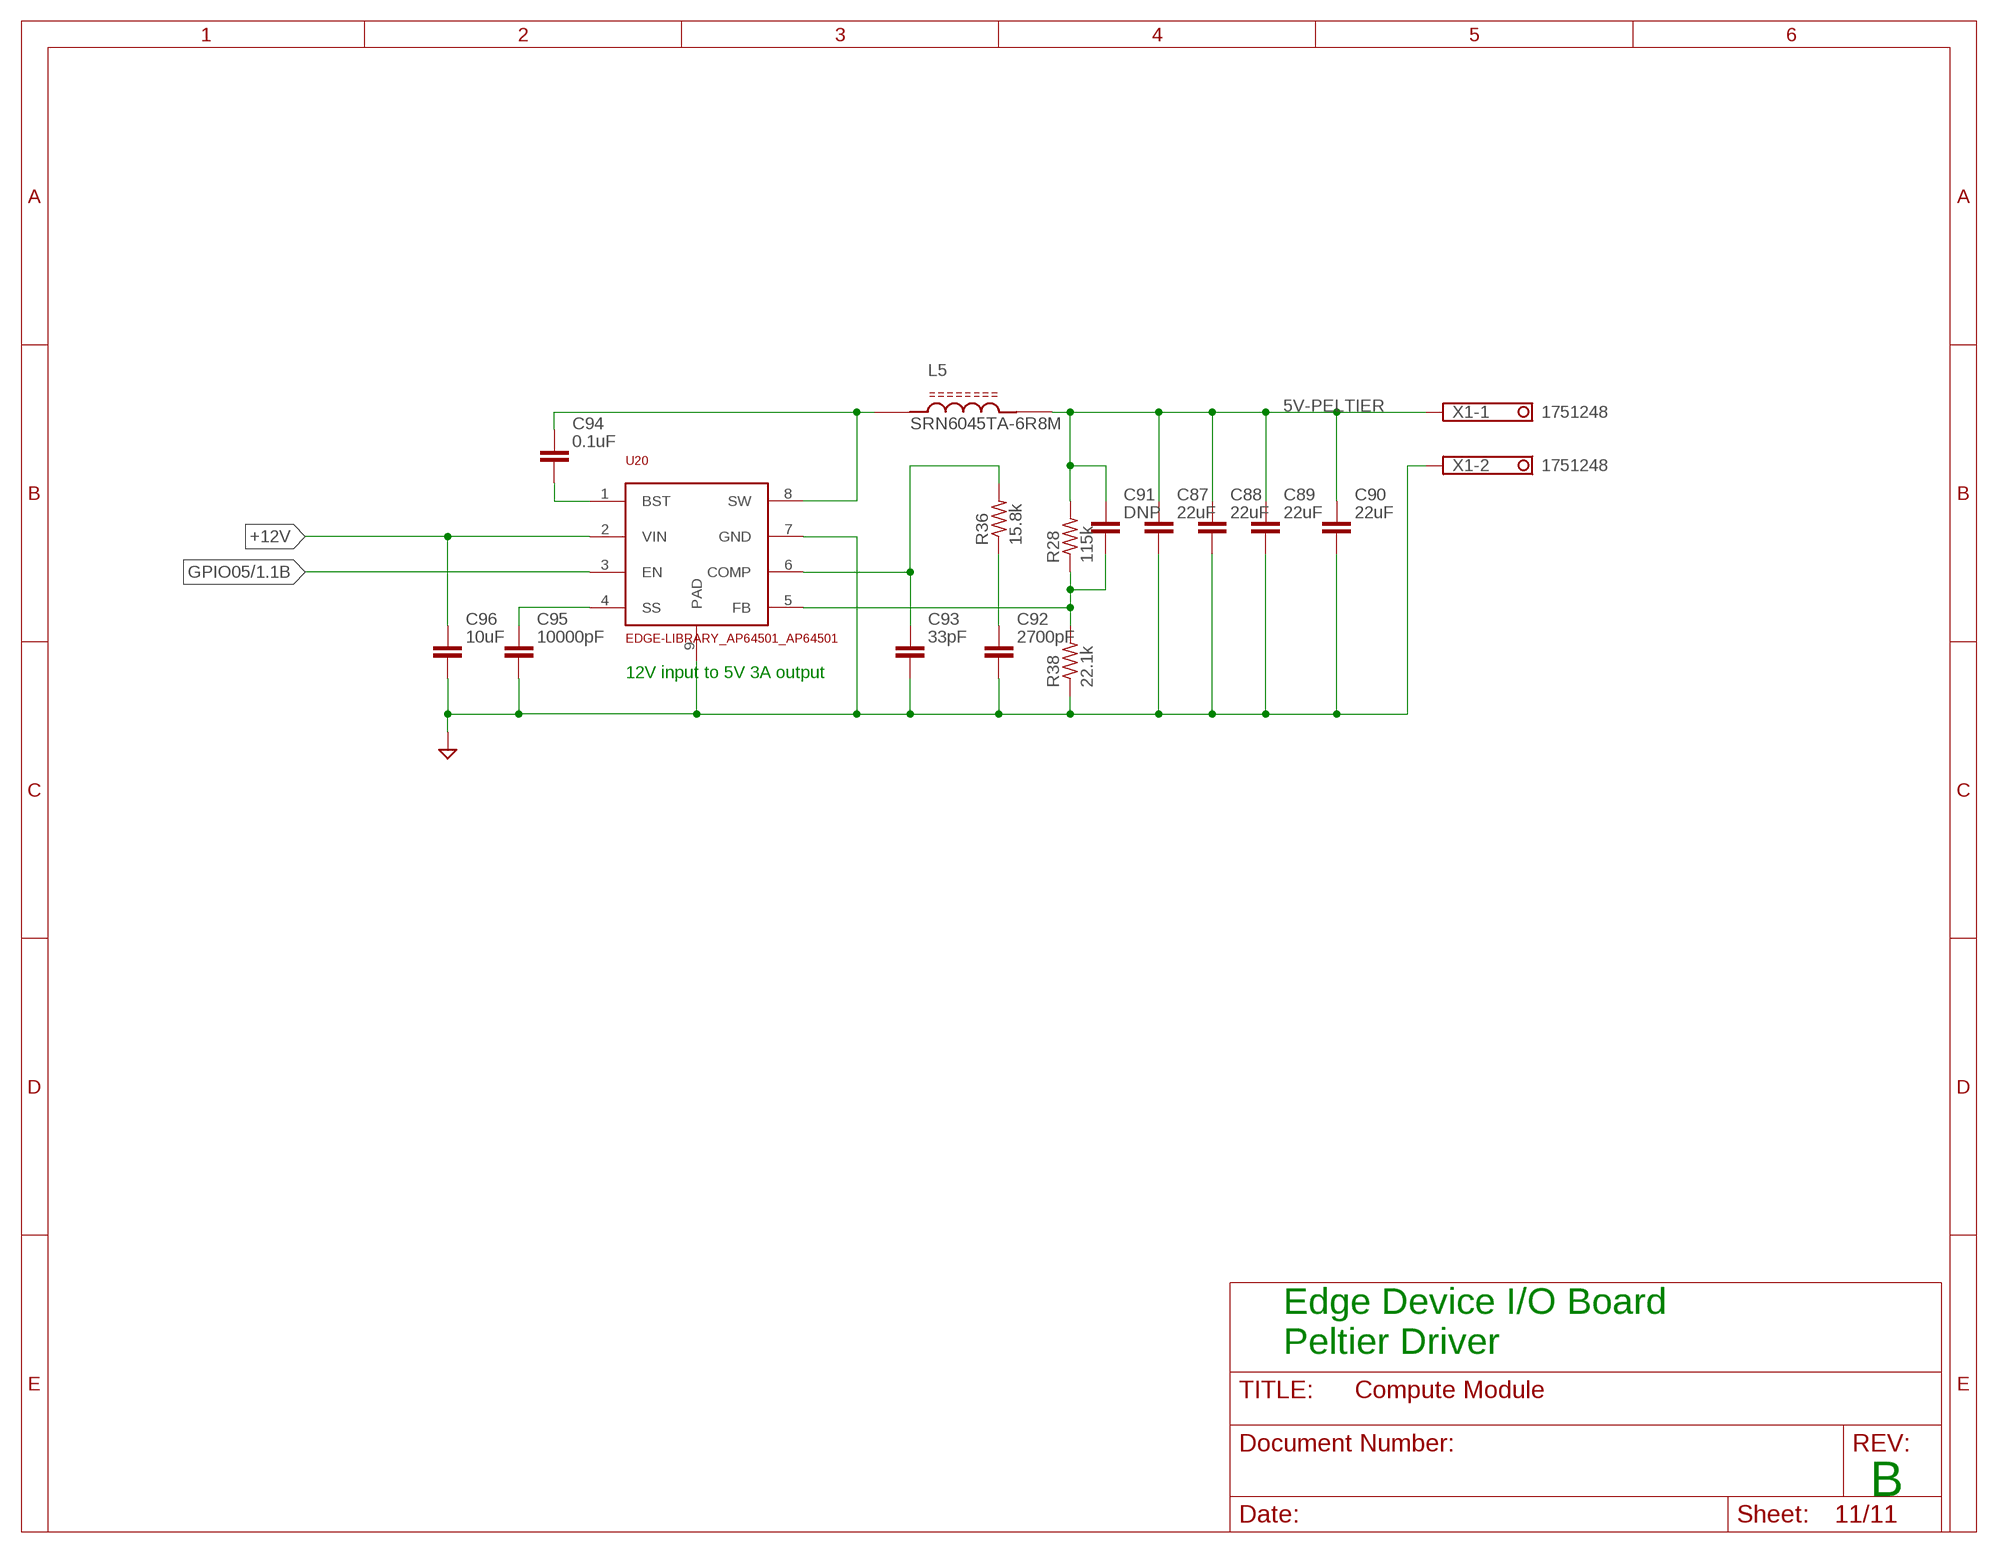
[diagram p10: schematic, sheet 11]

### Parts
C87  22uF  EDGE-LIBRARY_TUTORIAL---FUSION-360_CCHIP-0402(1005-METRIC)  [EDGE-LIBRARY_TUTORIAL---FUSION-360_CAPC1005X60]
C88  22uF  EDGE-LIBRARY_TUTORIAL---FUSION-360_CCHIP-0402(1005-METRIC)  [EDGE-LIBRARY_TUTORIAL---FUSION-360_CAPC1005X60]
C89  22uF  EDGE-LIBRARY_TUTORIAL---FUSION-360_CCHIP-0402(1005-METRIC)  [EDGE-LIBRARY_TUTORIAL---FUSION-360_CAPC1005X60]
C90  22uF  EDGE-LIBRARY_TUTORIAL---FUSION-360_CCHIP-0402(1005-METRIC)  [EDGE-LIBRARY_TUTORIAL---FUSION-360_CAPC1005X60]
C91  DNP  EDGE-LIBRARY_TUTORIAL---FUSION-360_CCHIP-0402(1005-METRIC)  [EDGE-LIBRARY_TUTORIAL---FUSION-360_CAPC1005X60]
C92  2700pF  EDGE-LIBRARY_TUTORIAL---FUSION-360_CCHIP-0402(1005-METRIC)  [EDGE-LIBRARY_TUTORIAL---FUSION-360_CAPC1005X60]
C93  33pF  EDGE-LIBRARY_TUTORIAL---FUSION-360_CCHIP-0402(1005-METRIC)  [EDGE-LIBRARY_TUTORIAL---FUSION-360_CAPC1005X60]
C94  0.1uF  EDGE-LIBRARY_TUTORIAL---FUSION-360_CCHIP-0402(1005-METRIC)  [EDGE-LIBRARY_TUTORIAL---FUSION-360_CAPC1005X60]
C95  10000pF  EDGE-LIBRARY_TUTORIAL---FUSION-360_CCHIP-0402(1005-METRIC)  [EDGE-LIBRARY_TUTORIAL---FUSION-360_CAPC1005X60]
C96  10uF  EDGE-LIBRARY_TUTORIAL---FUSION-360_CCHIP-0805(2012-METRIC)  [EDGE-LIBRARY_TUTORIAL---FUSION-360_CAPC2012X110]
L5  EDGE-LIBRARY_SRN6045TA-3R3Y_SRN6045TA-3R3Y  [EDGE-LIBRARY_SRN6045TA-3R3Y_IND_SRN6045TA-3R3Y]
R28  115k  EDGE-LIBRARY_TUTORIAL---FUSION-360_R-USCHIP-0402(1005-METRIC)  [EDGE-LIBRARY_TUTORIAL---FUSION-360_RESC1005X40]
R36  15.8k  EDGE-LIBRARY_TUTORIAL---FUSION-360_R-USCHIP-0402(1005-METRIC)  [EDGE-LIBRARY_TUTORIAL---FUSION-360_RESC1005X40]
R38  22.1k  EDGE-LIBRARY_TUTORIAL---FUSION-360_R-USCHIP-0402(1005-METRIC)  [EDGE-LIBRARY_TUTORIAL---FUSION-360_RESC1005X40]
U20  EDGE-LIBRARY_AP64501_AP64501  [EDGE-LIBRARY_AP64501_SOIC127P600X265-9T261X350N]
X1  1751248  [1751248]

### Nets
5V-PELTIER: C87.1 C88.1 C89.1 C90.1 C91.1 L5.2 R28.2 X1.1
+12V: C96.1 U20.2(VIN) ; also sheet 4,5,8
GND: C87.2 C88.2 C89.2 C90.2 C92.2 C93.2 C95.2 C96.2 R38.1 U20.7(GND) U20.9(PAD) X1.2 ; supply symbol labelled SUPPLY1_GND ; also sheet 1,2,3,4,5,6,7,8,9,10
GPIO05: U20.3(EN) ; also sheet 1,3
N$29: C94.2 U20.1(BST)
N$77: C94.1 L5.1 U20.8(SW)
N$78: C95.1 U20.4(SS)
N$79: C93.1 R36.2 U20.6(COMP)
N$80: C92.1 R36.1
N$81: C91.2 R28.1 R38.2 U20.5(FB)

### Notes on the sheet
- 12V input to 5V 3A output
- Edge Device I/O Board
  Peltier Driver
- B